# EAGLE schematic fmc-host (EAGLE 8.3.2)
DESIGNER: JON NEWMAN; DESIGN_NAME: FMC DESERIALIZER; LICENSE: CC BY-NC-SA 4.0; REVISION: 1.5
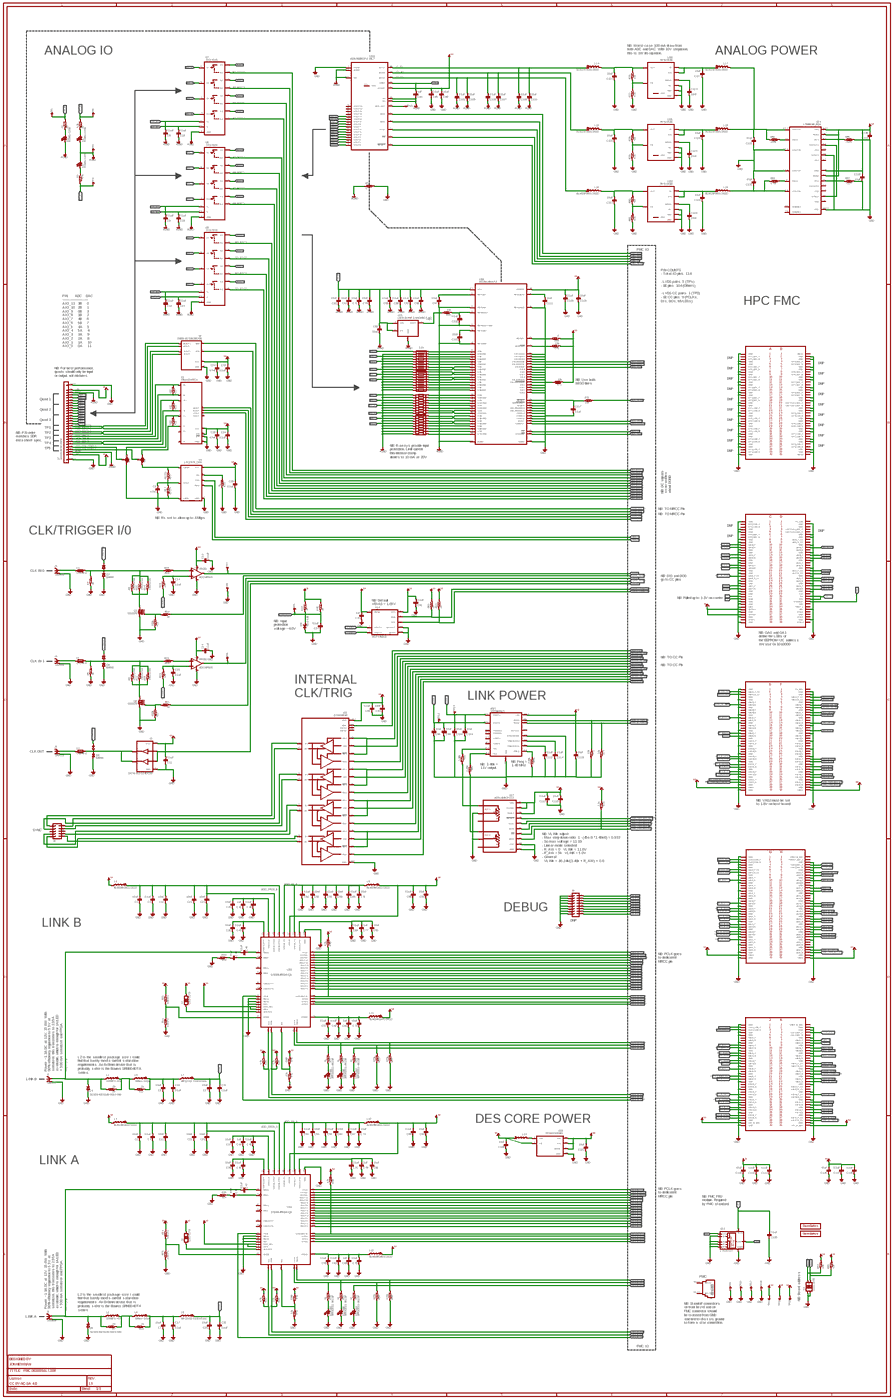
[diagram p0: schematic, sheet 1, overview]
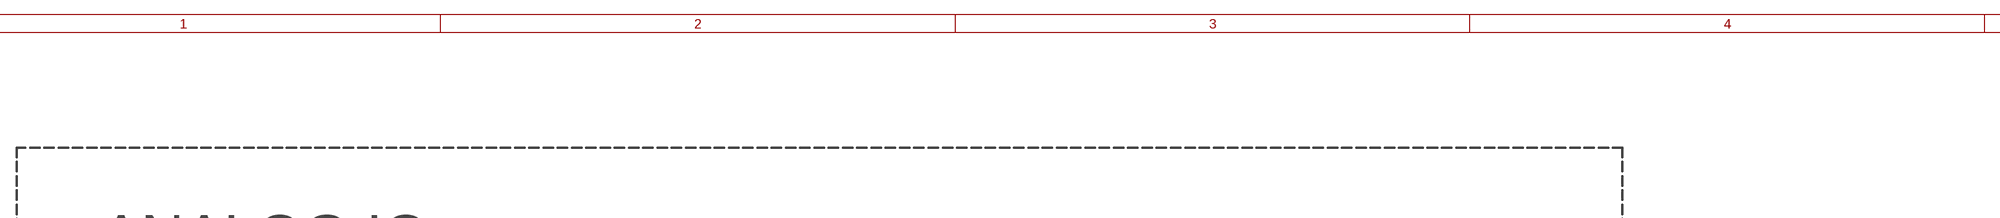
[diagram p1: schematic, sheet 1, part 1 of 8]
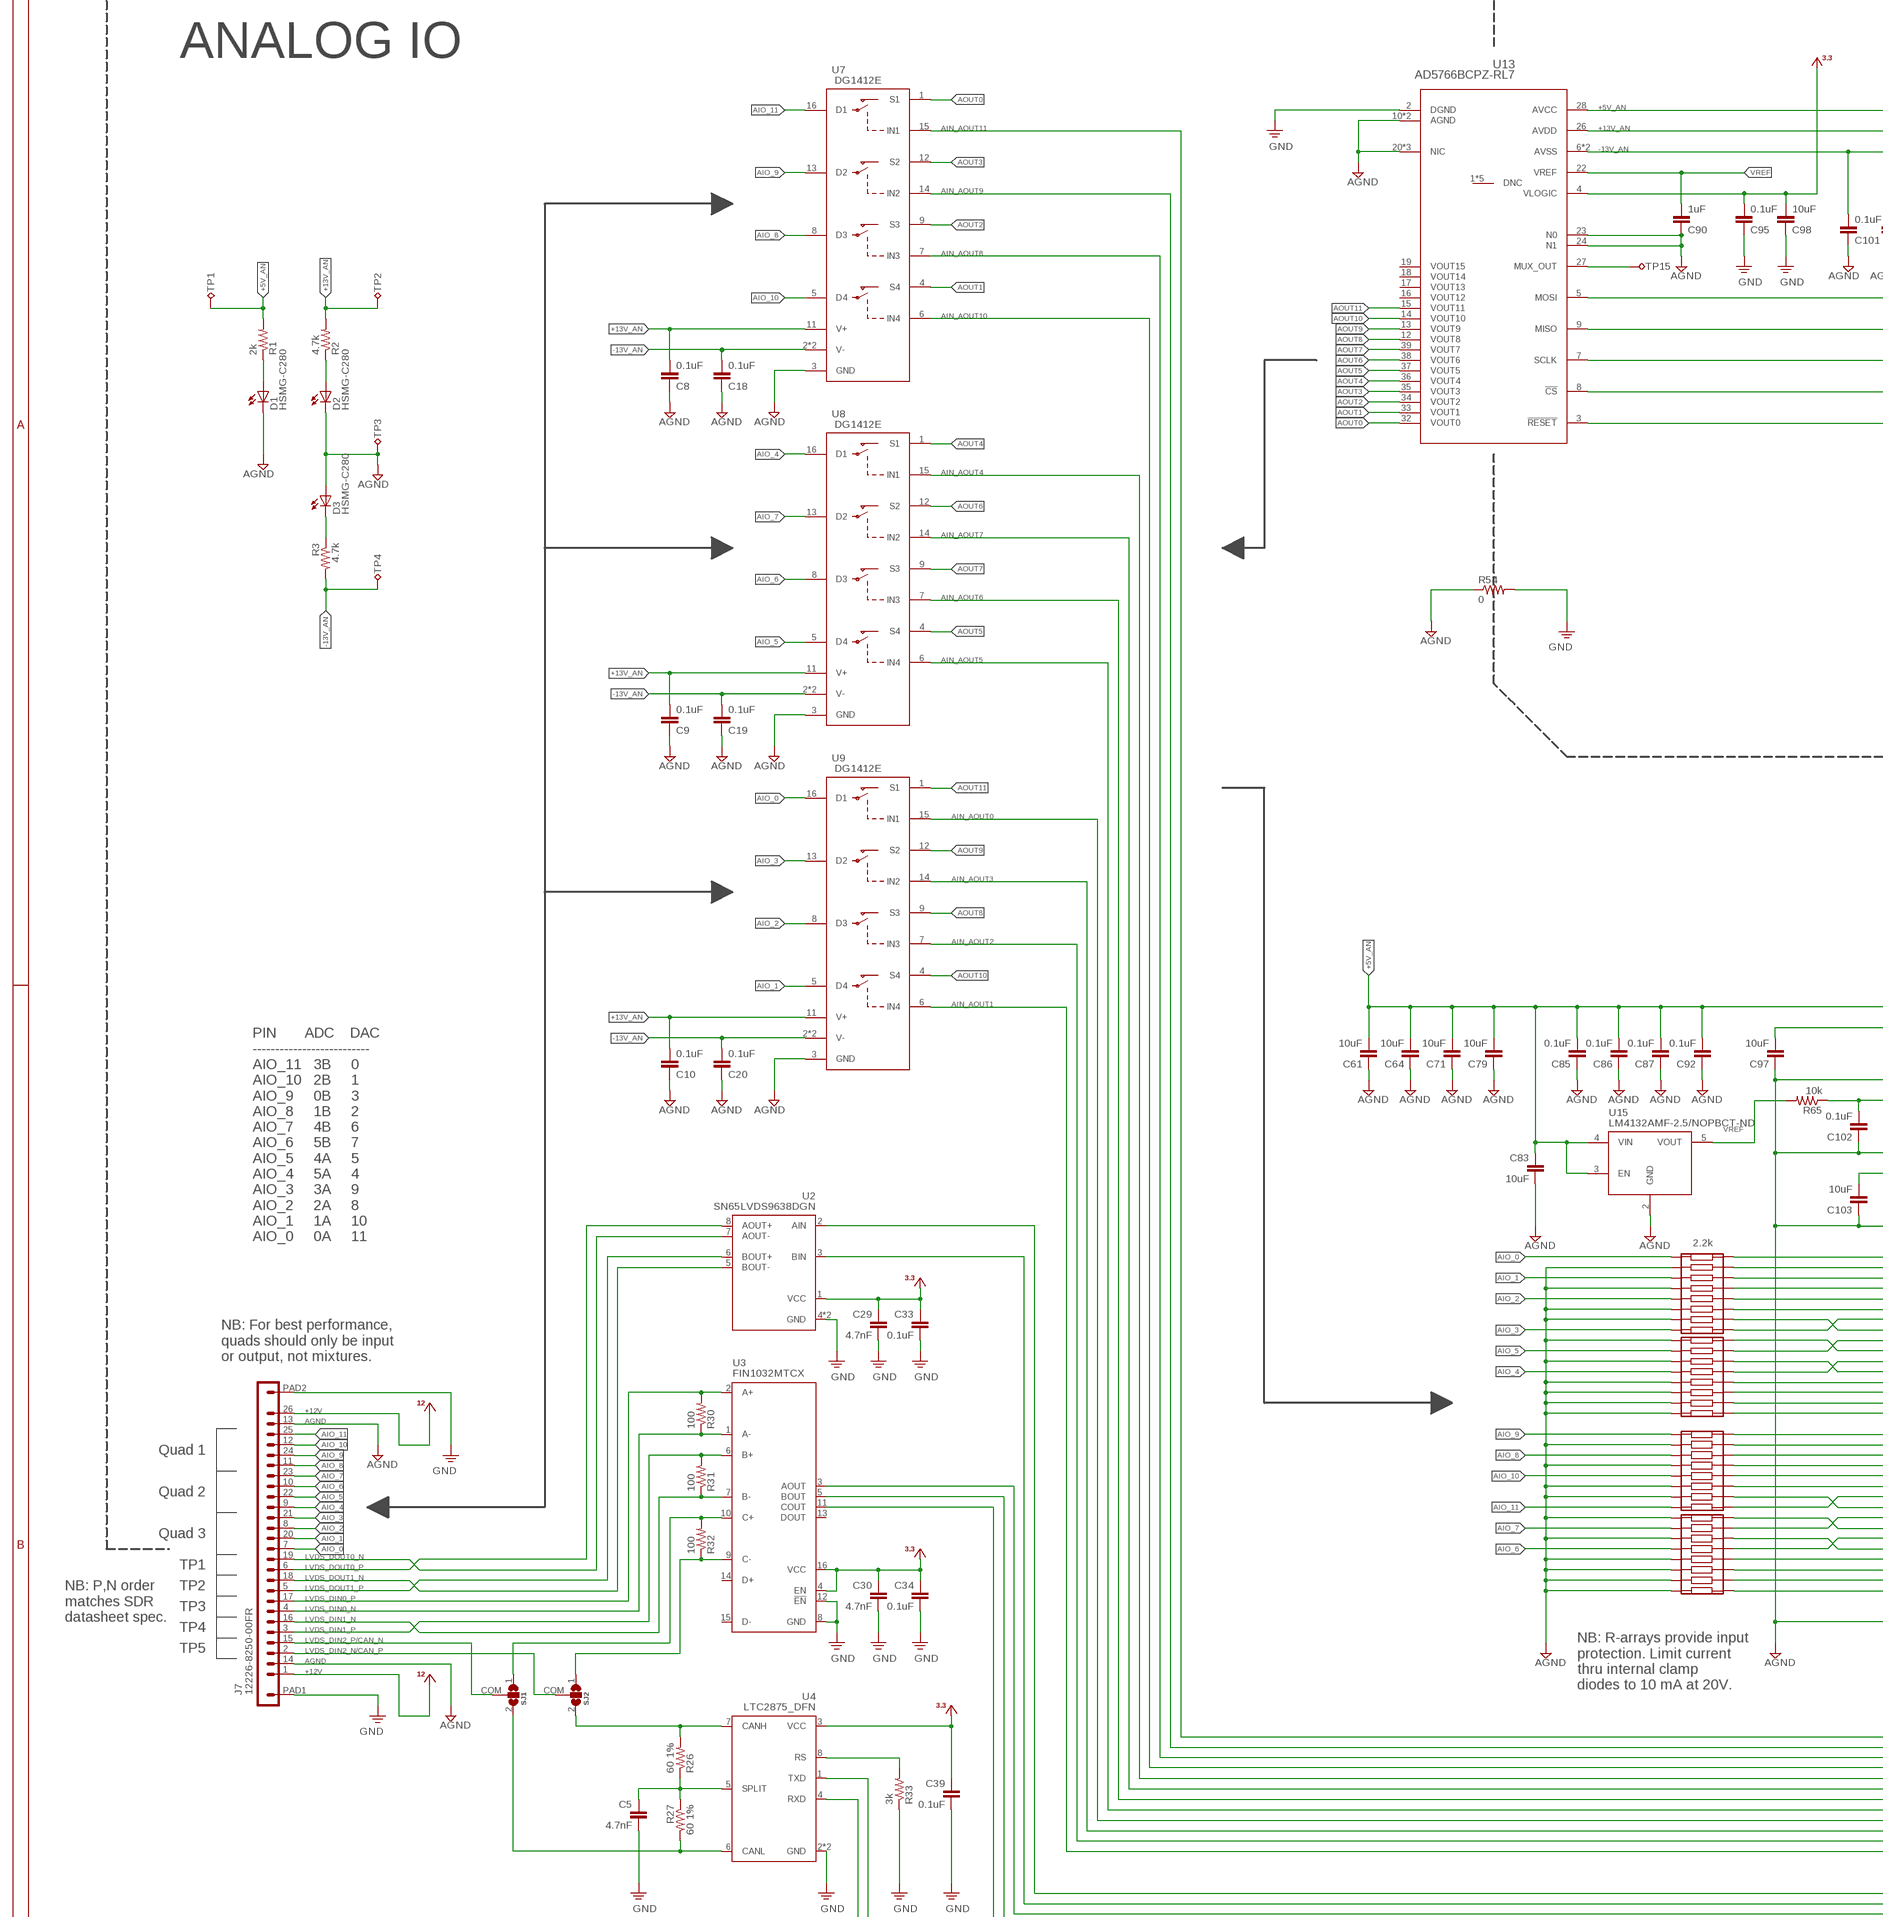
[diagram p2: schematic, sheet 1, part 2 of 8]
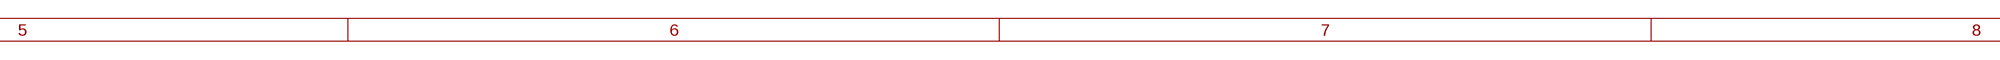
[diagram p3: schematic, sheet 1, part 3 of 8]
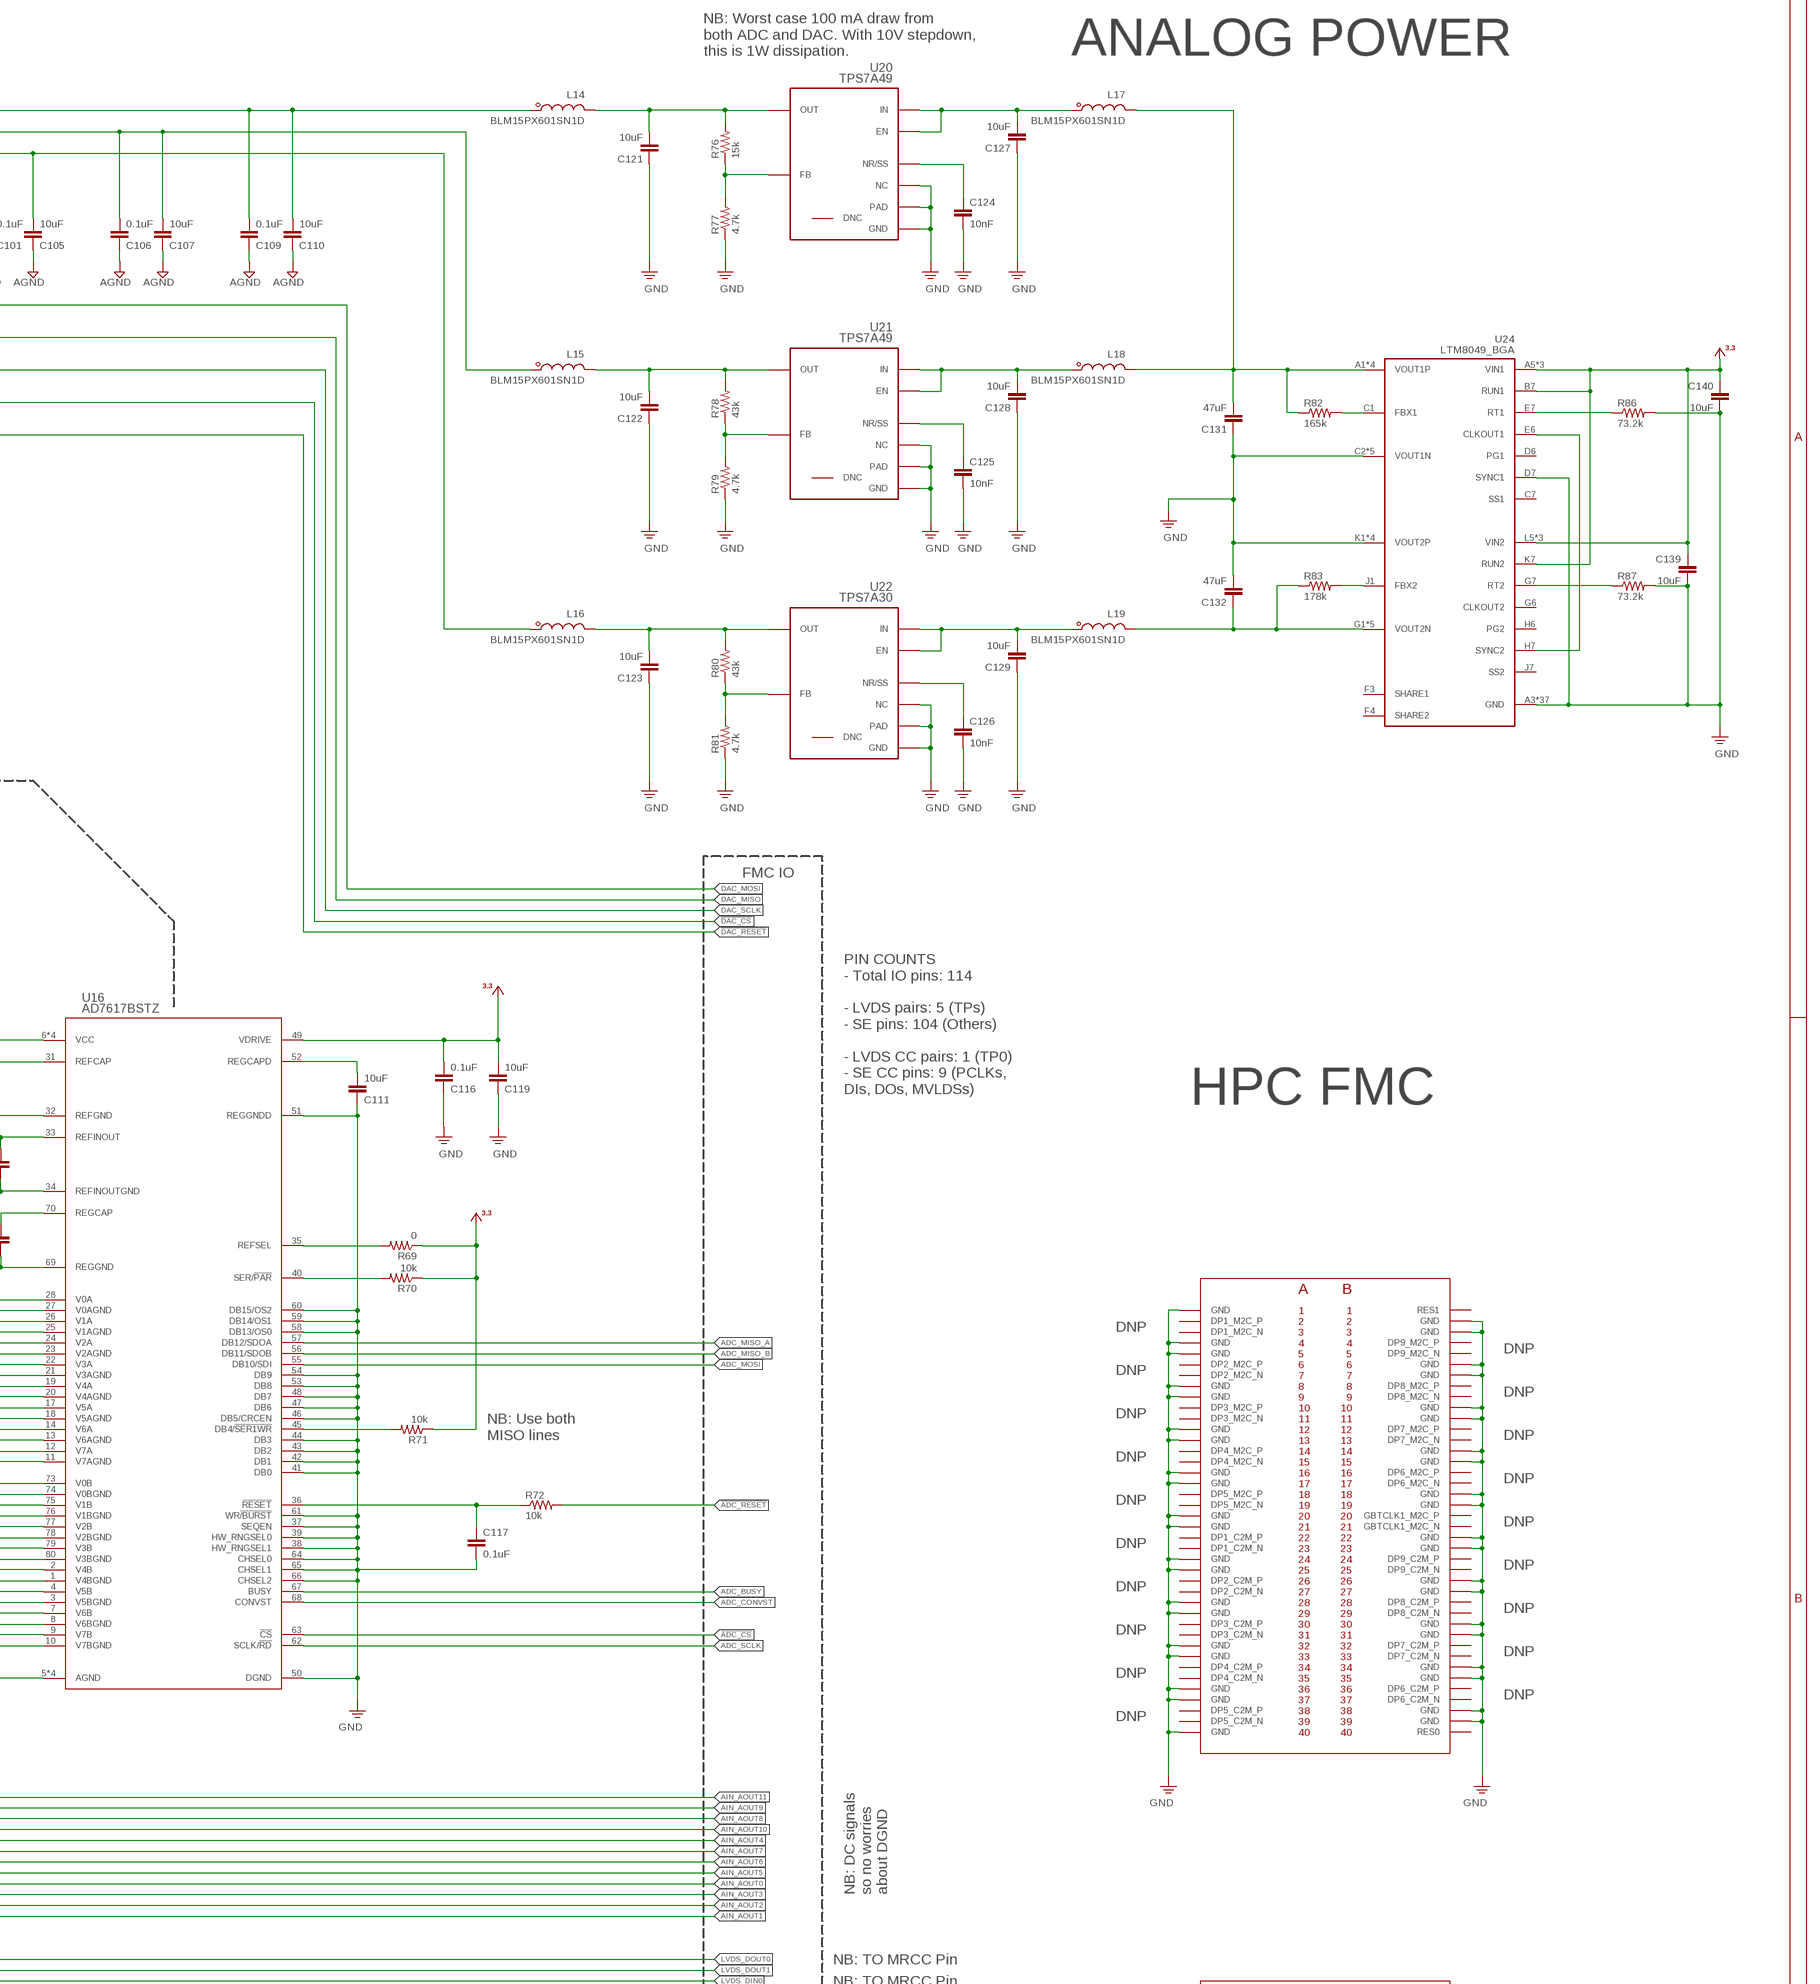
[diagram p4: schematic, sheet 1, part 4 of 8]
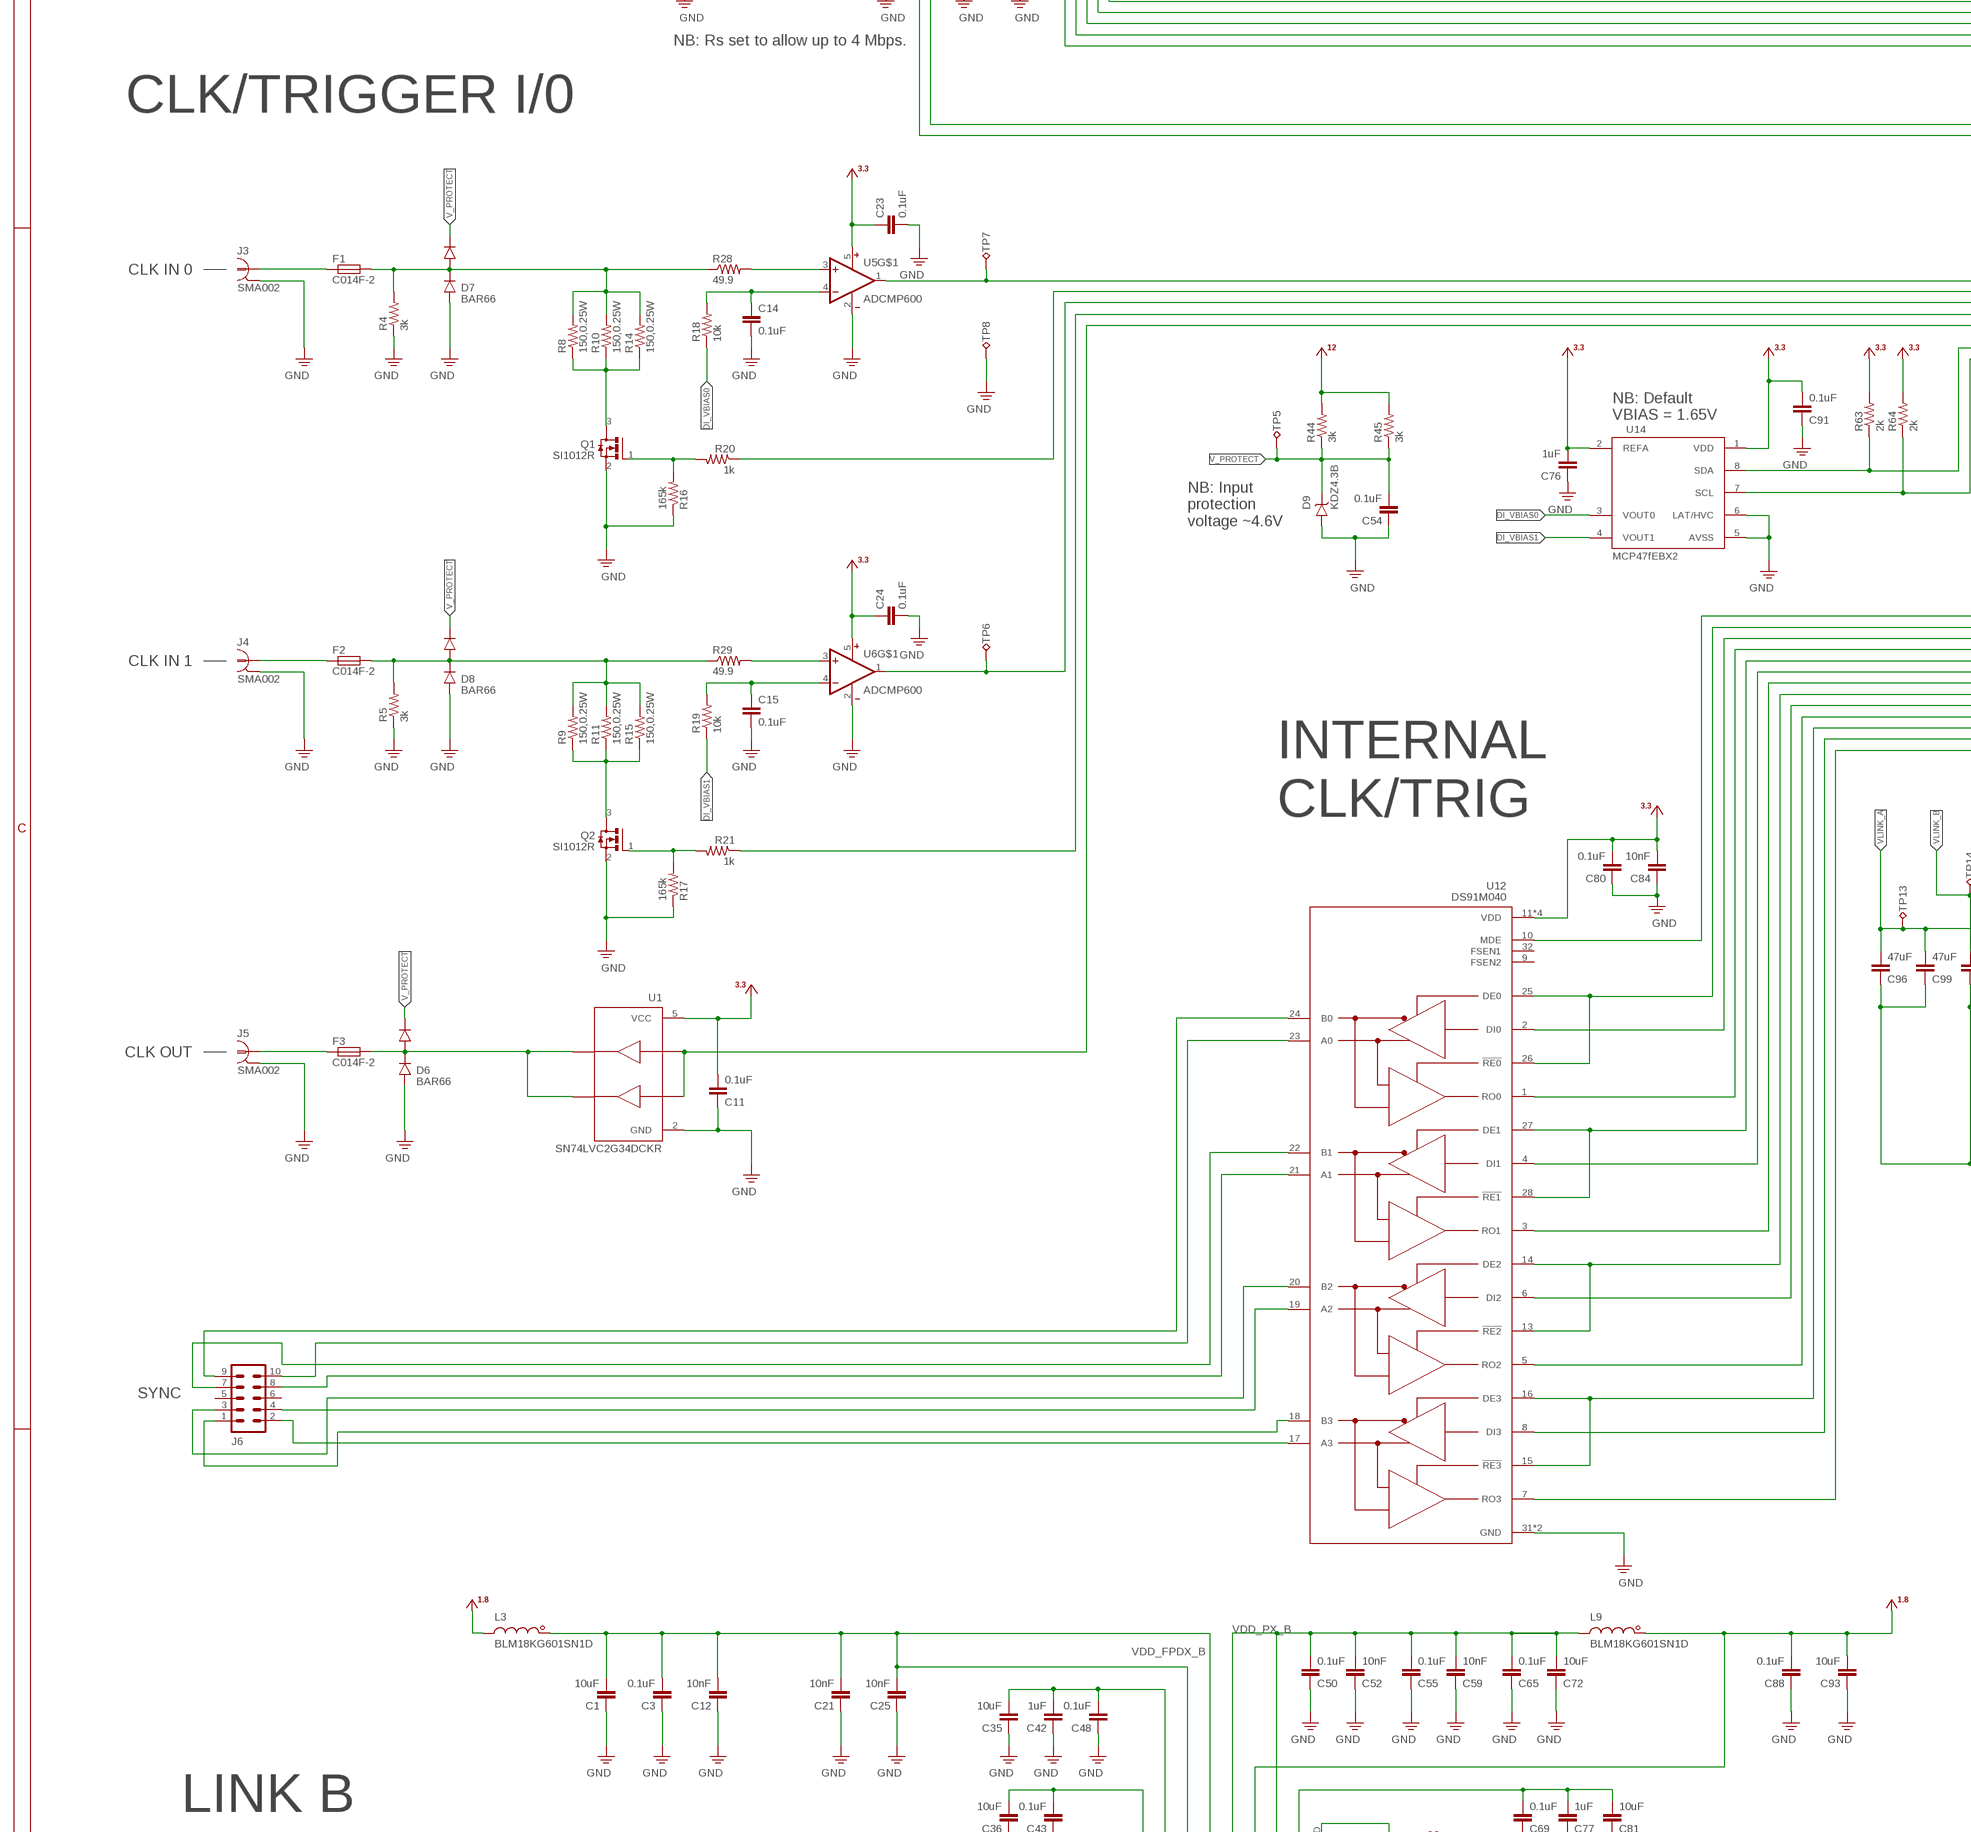
[diagram p5: schematic, sheet 1, part 5 of 8]
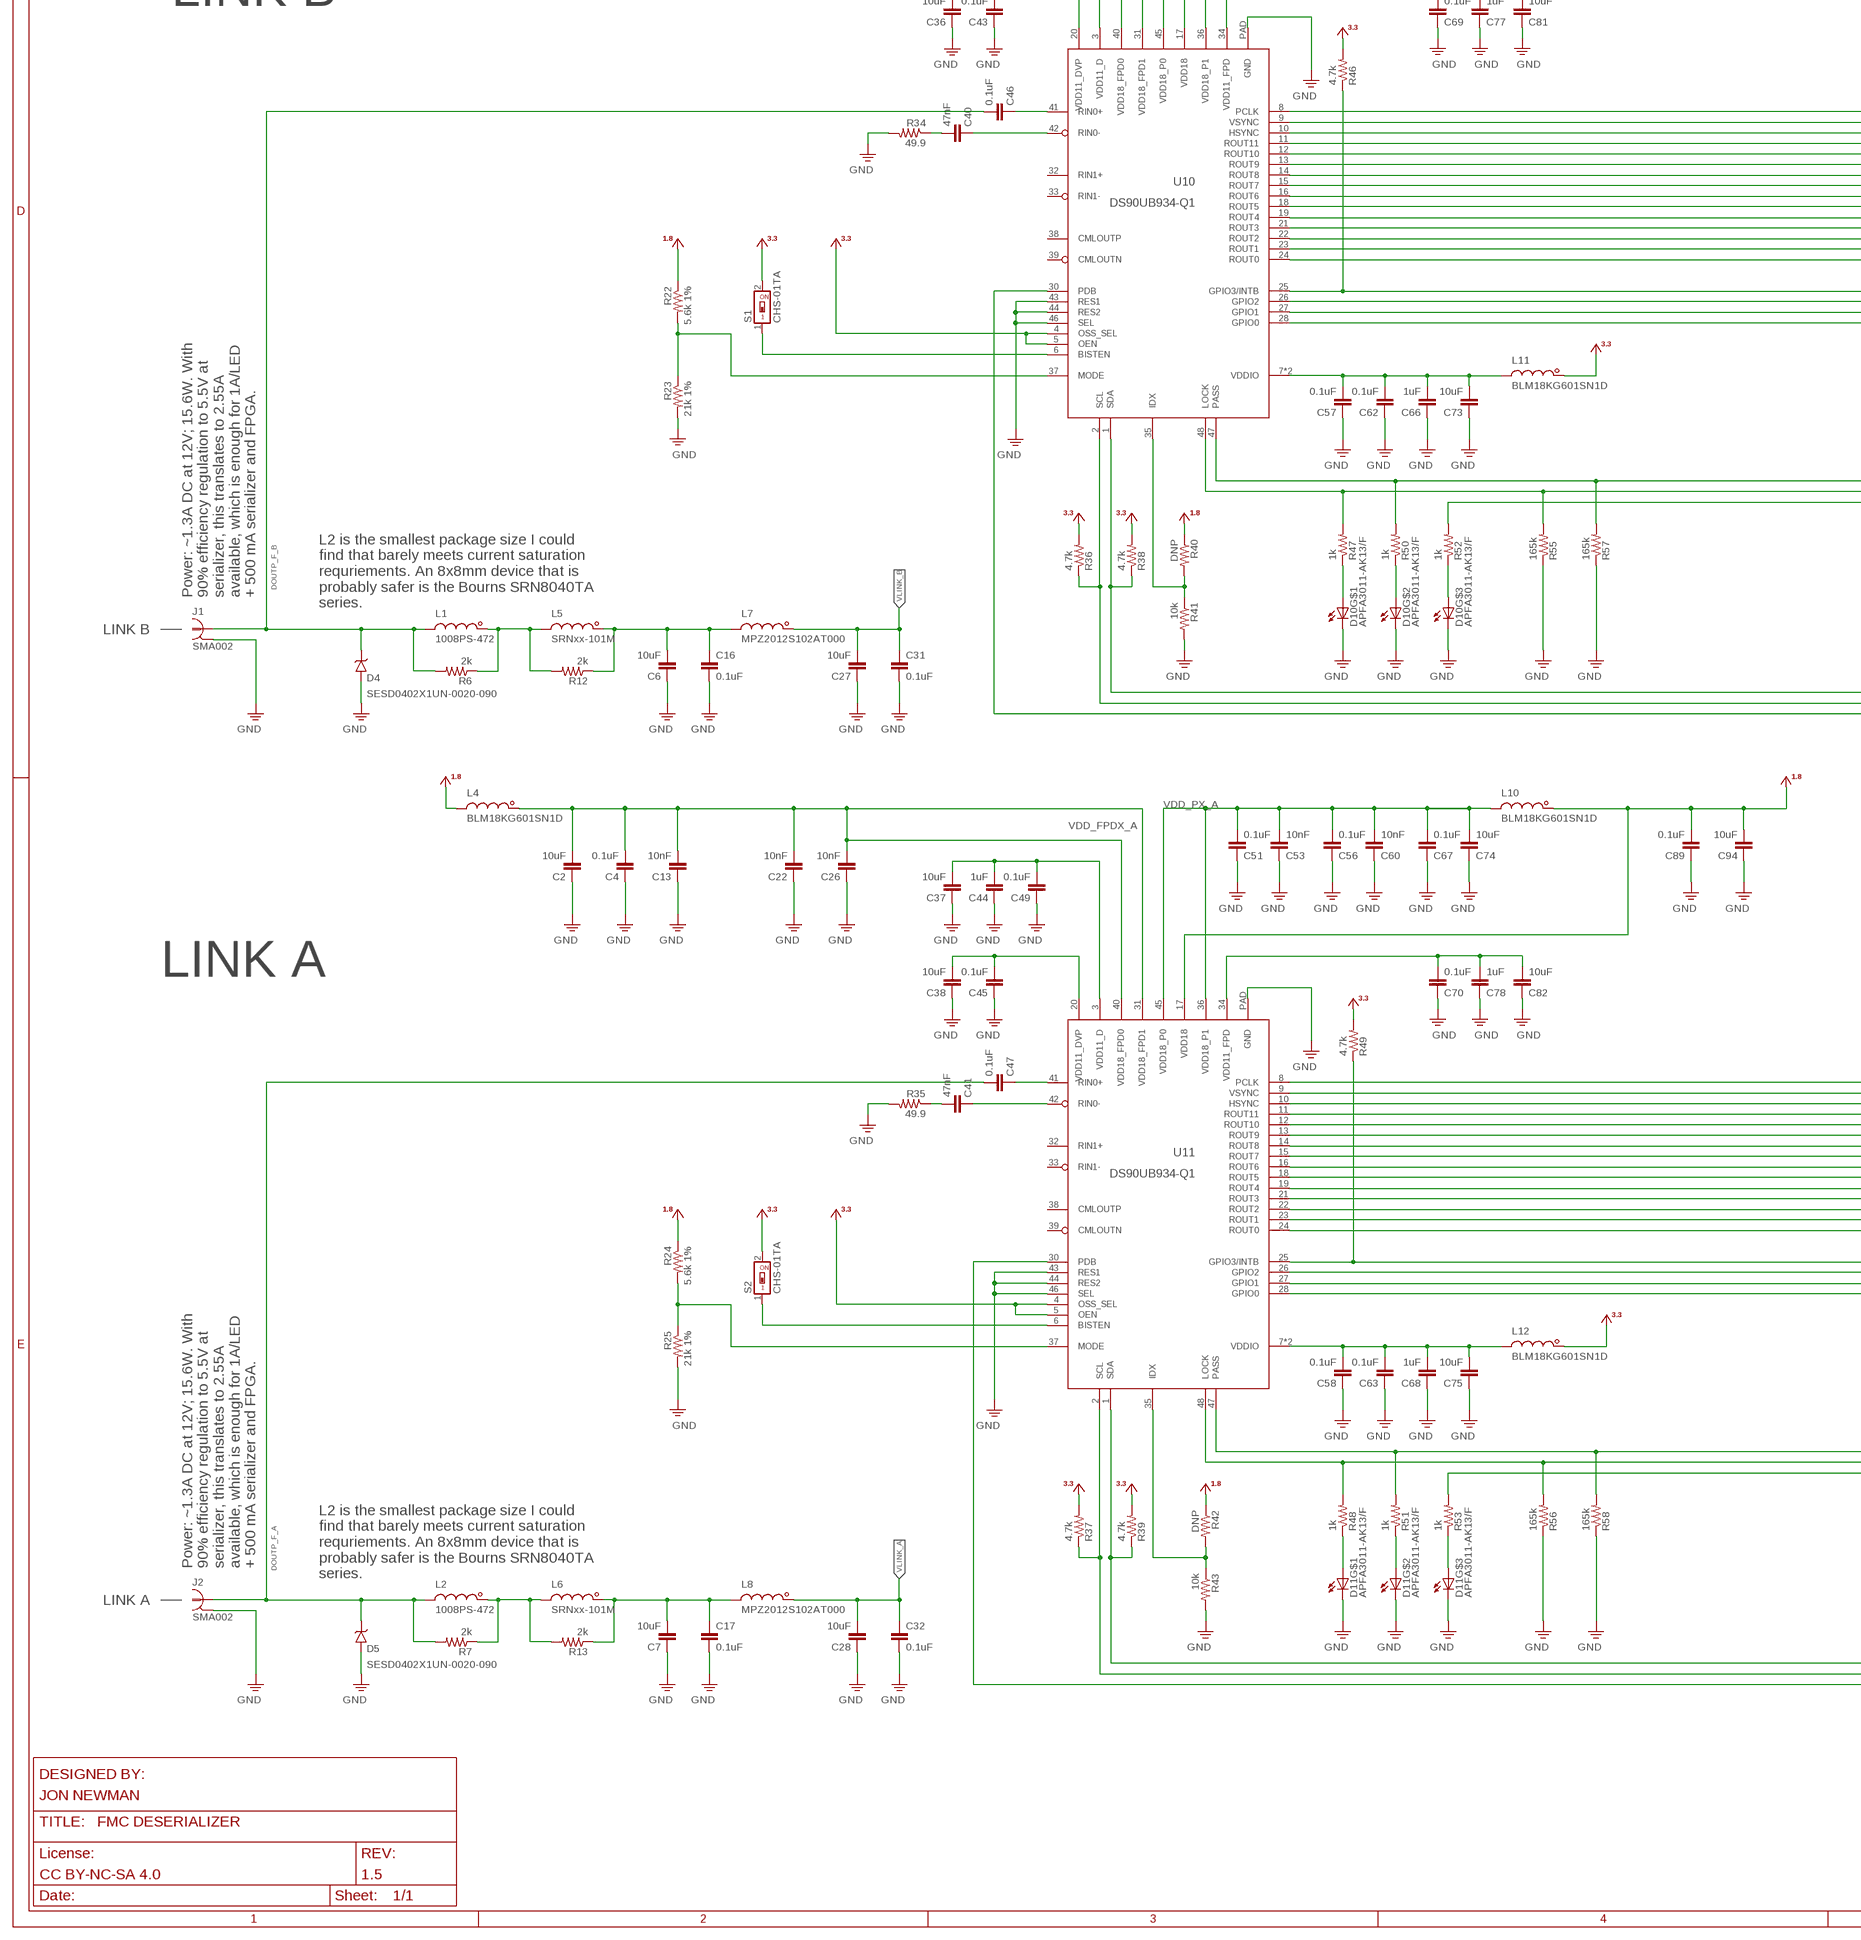
[diagram p6: schematic, sheet 1, part 6 of 8]
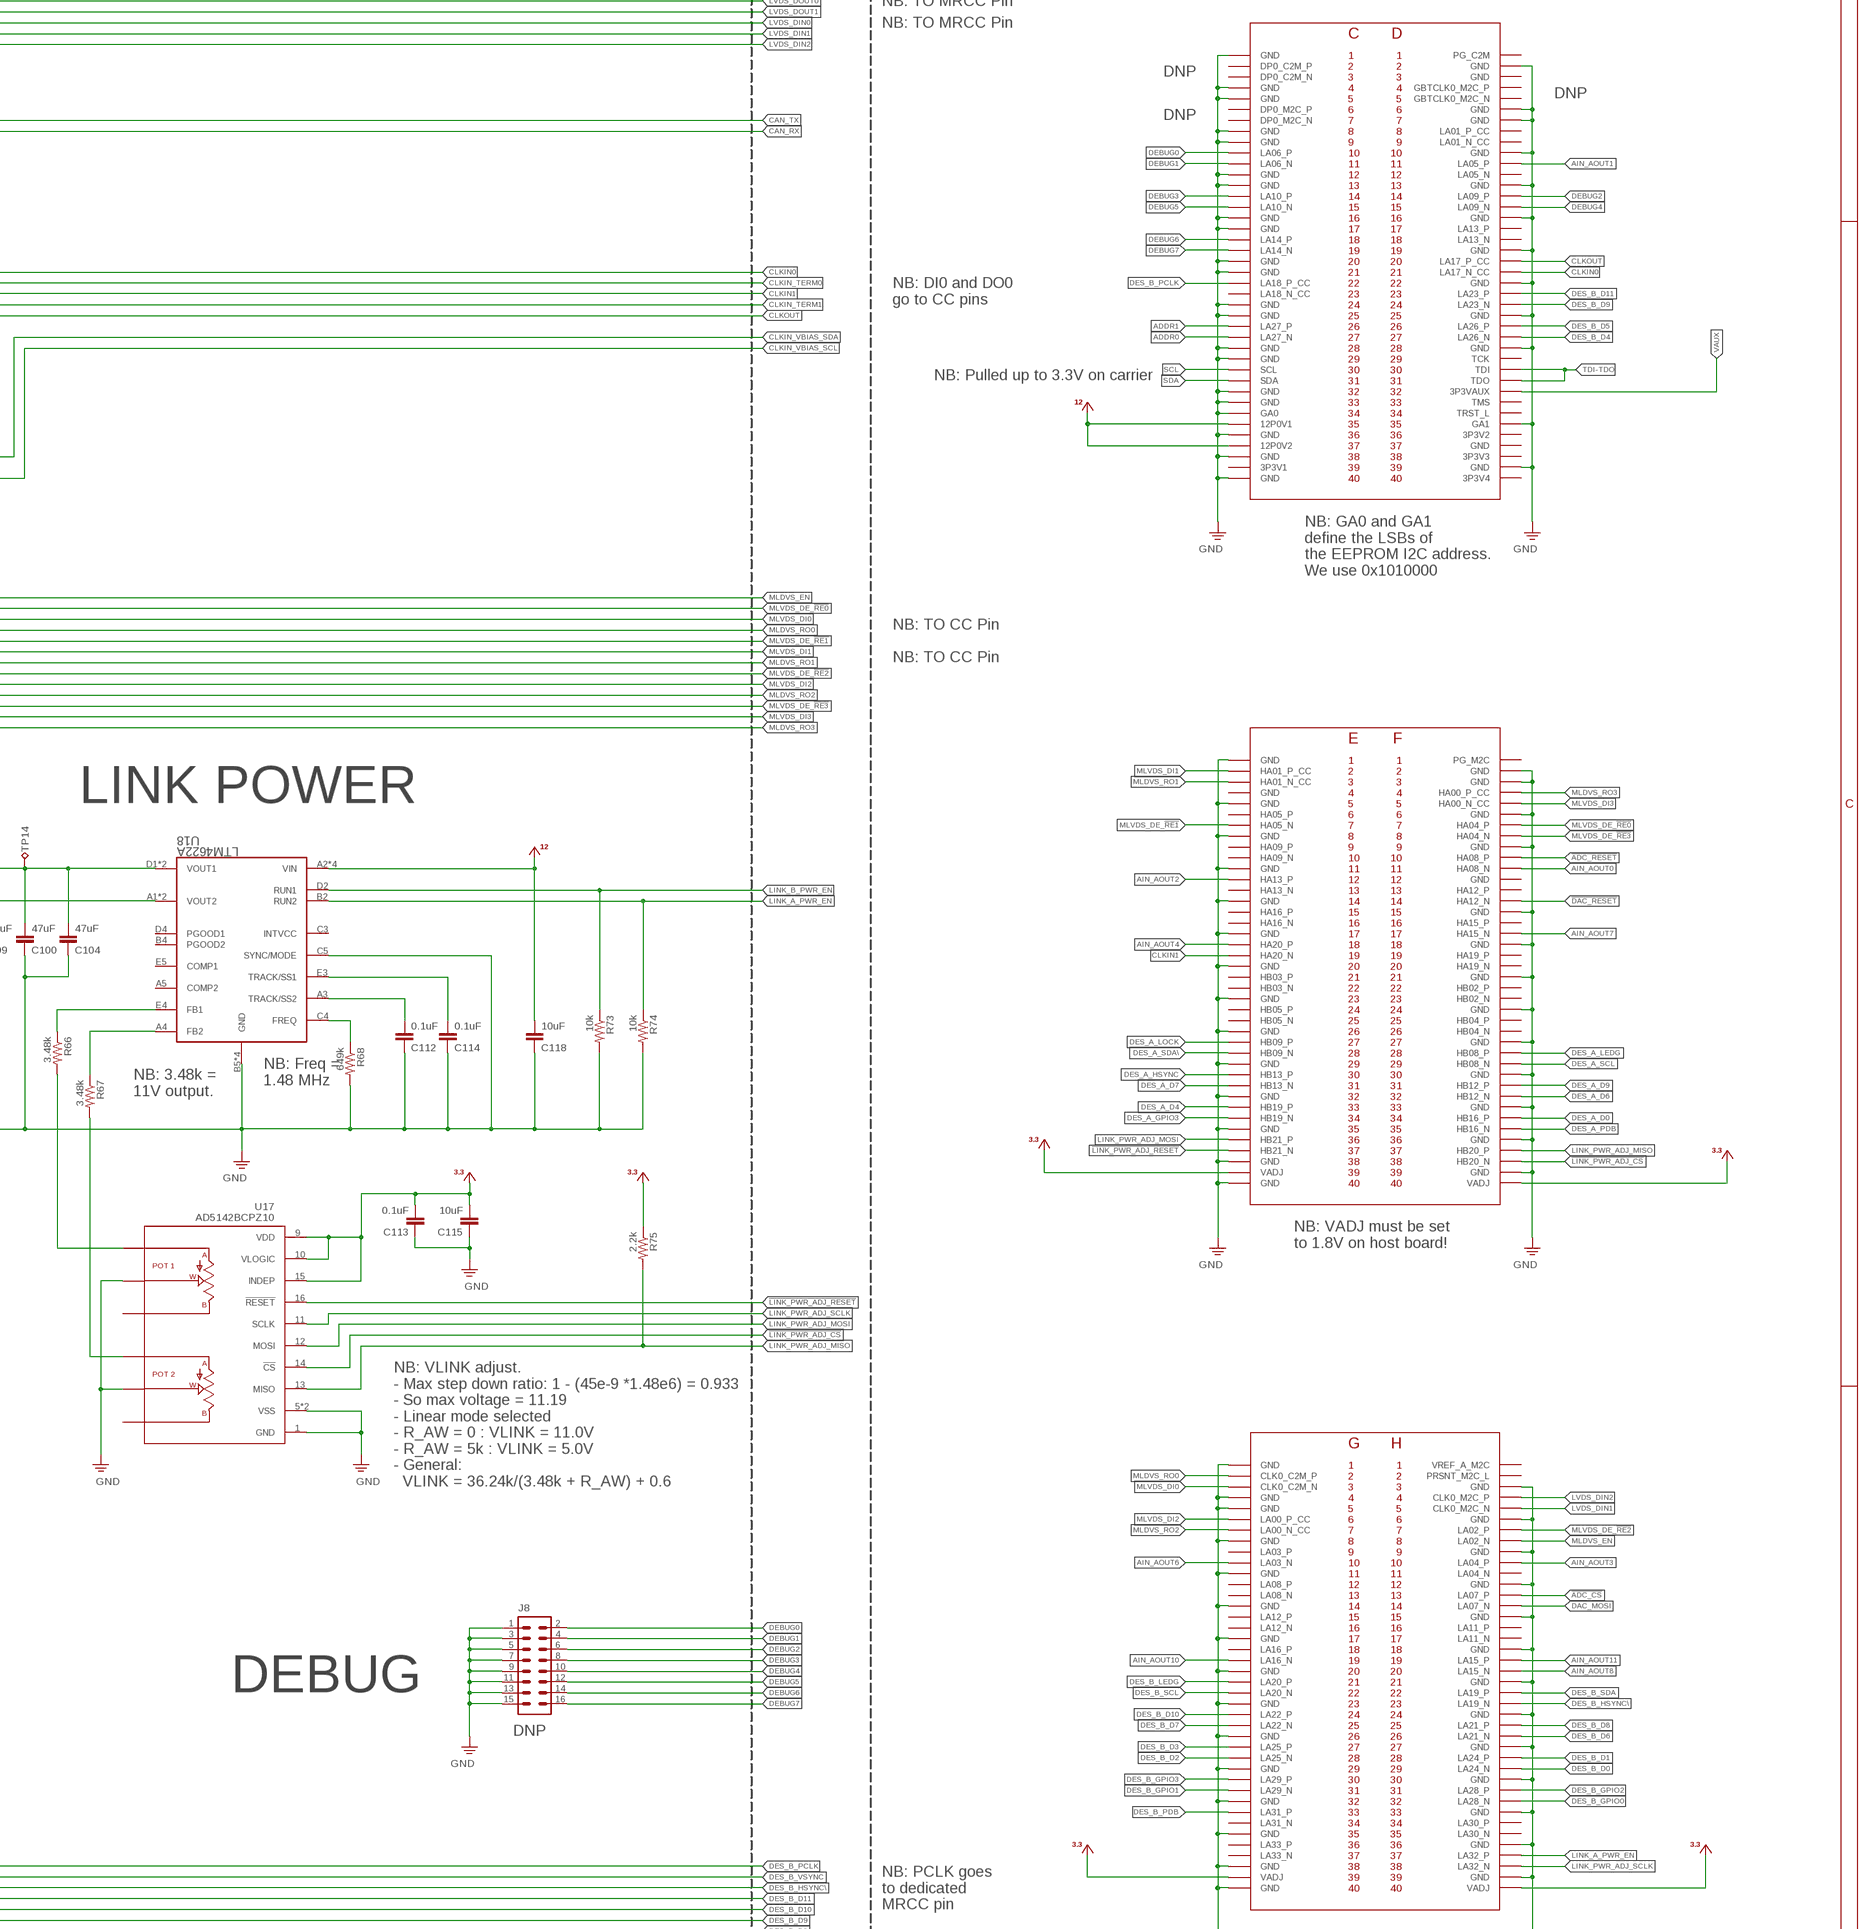
[diagram p7: schematic, sheet 1, part 7 of 8]
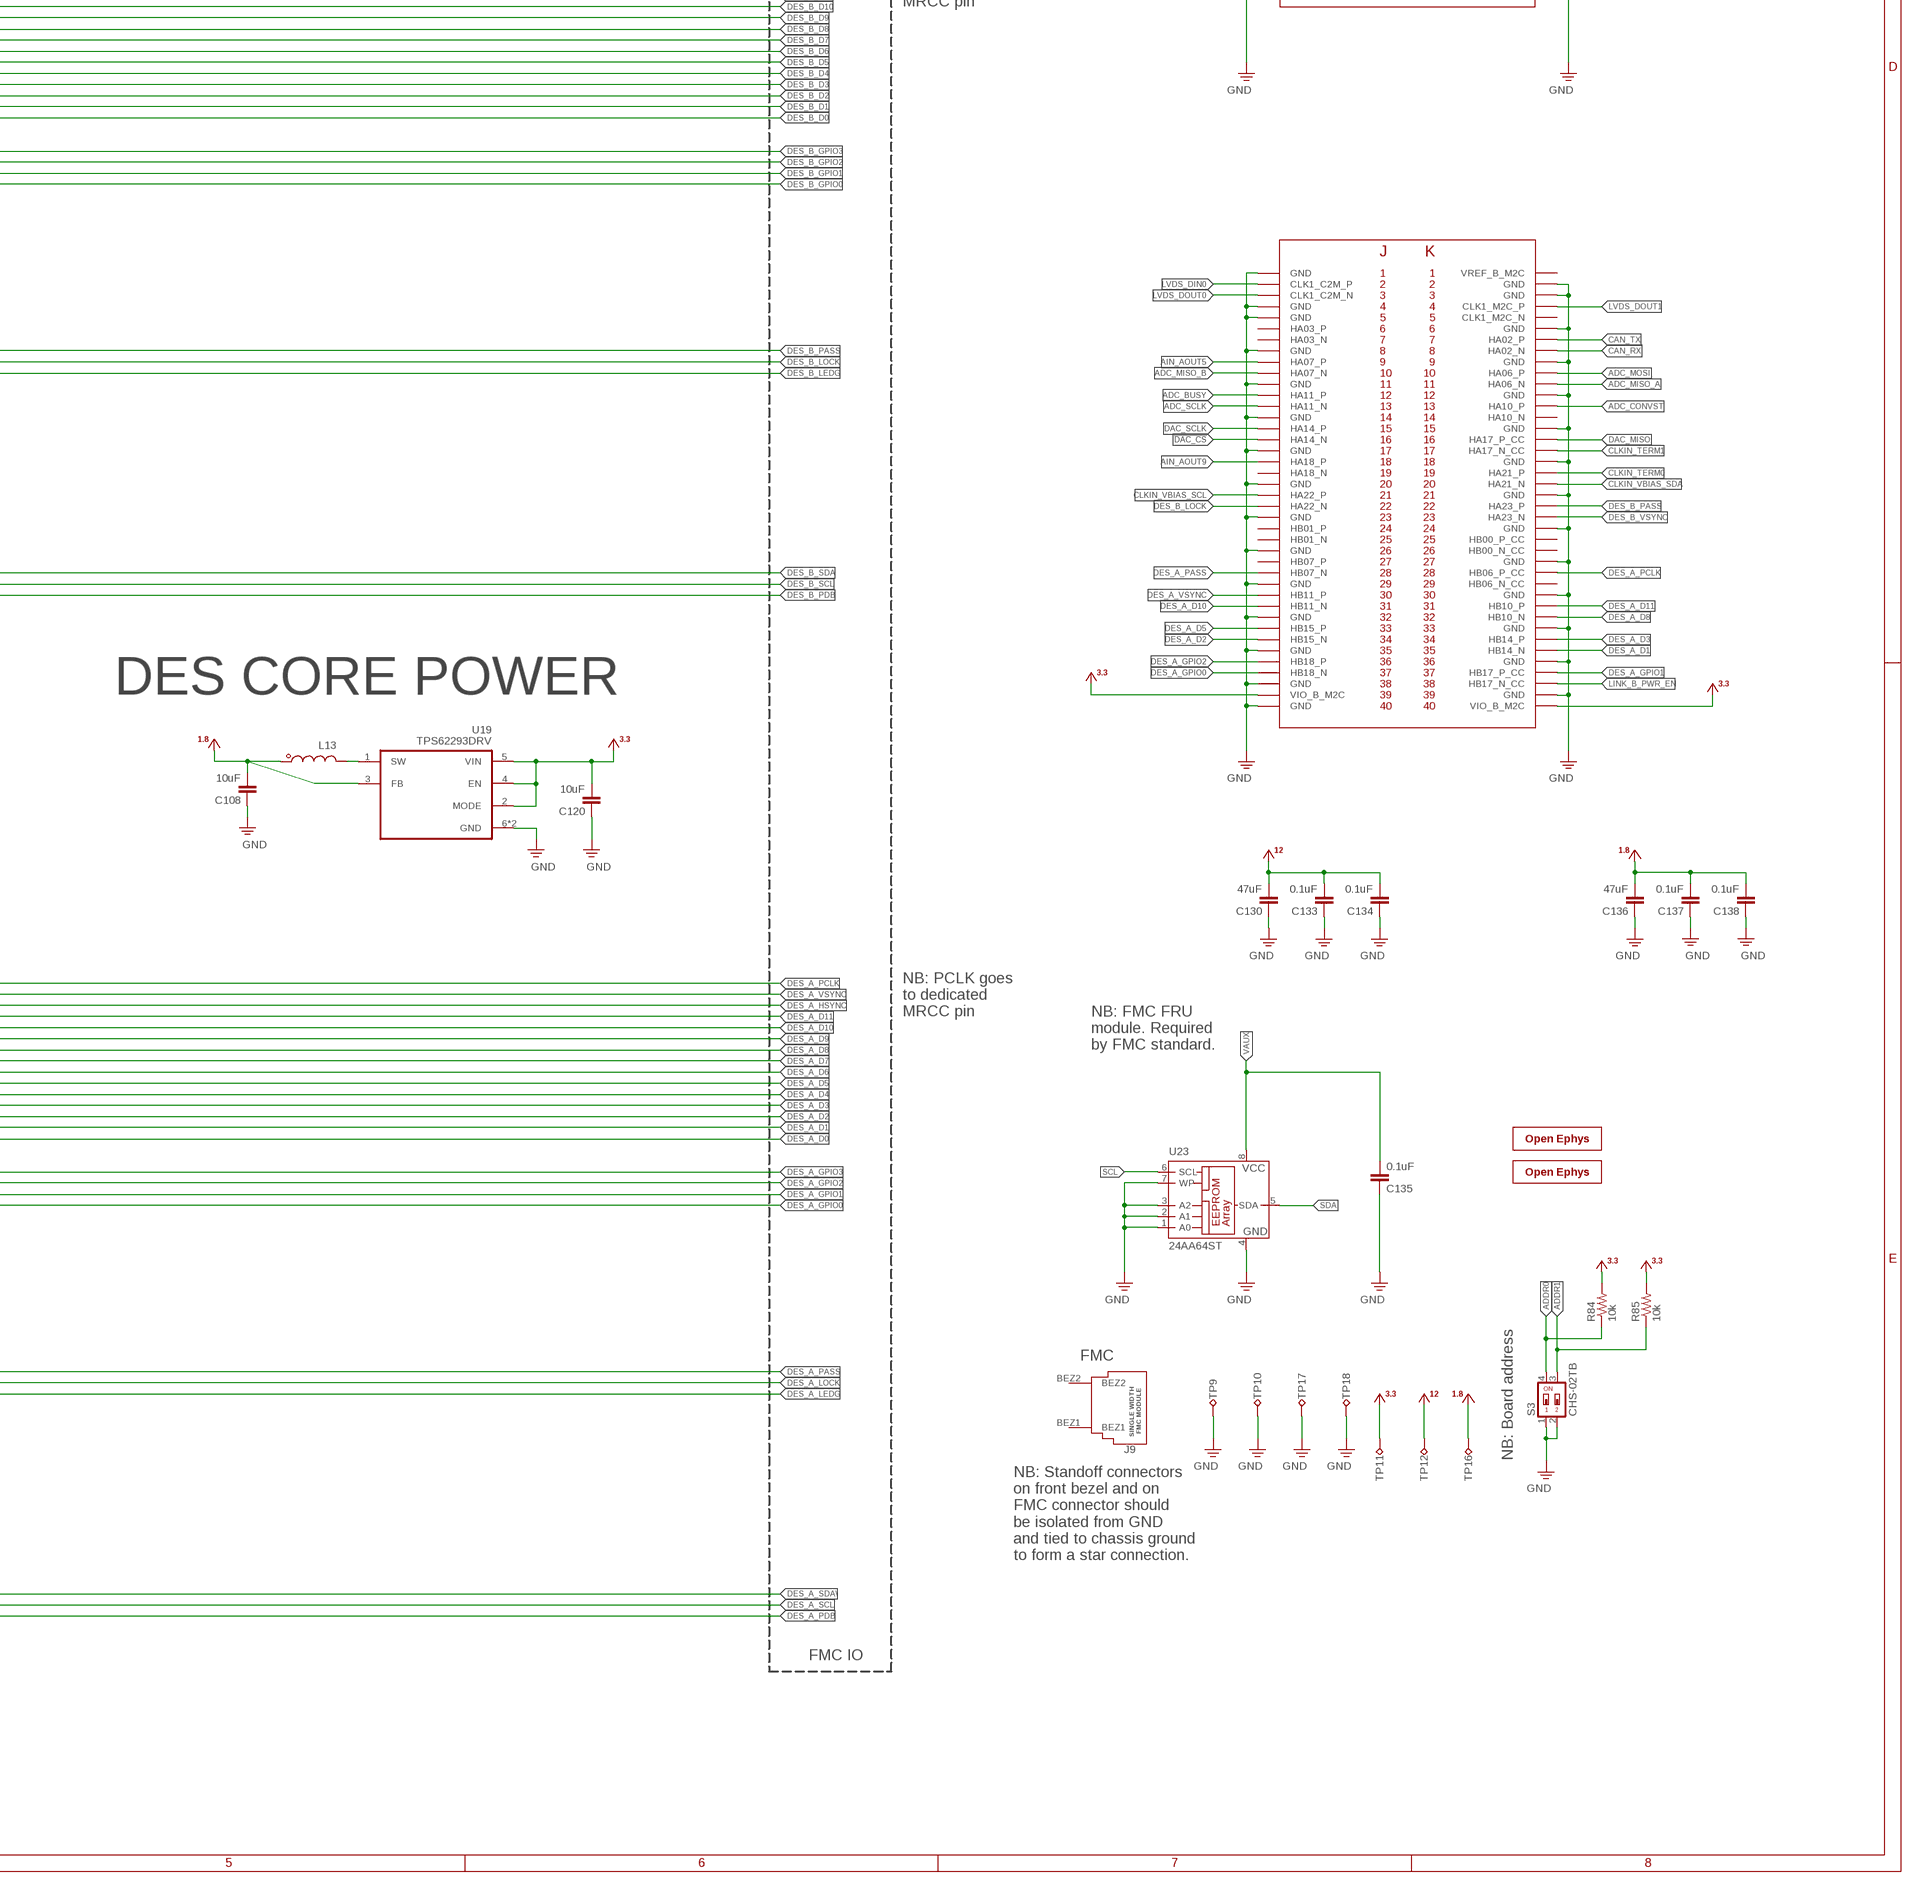
[diagram p8: schematic, sheet 1, part 8 of 8]

## Parts
C1  10uF  C_1206  [1206]
C2  10uF  C_1206  [1206]
C3  0.1uF  C_0402  [0402]
C4  0.1uF  C_0402  [0402]
C5  4.7nF  C_0402  [0402]
C6  10uF  C_1206  [1206]
C7  10uF  C_1206  [1206]
C8  0.1uF  C_0402  [0402]
C9  0.1uF  C_0402  [0402]
C10  0.1uF  C_0402  [0402]
C11  0.1uF  C_0402  [0402]
C12  10nF  C_0402  [0402]
C13  10nF  C_0402  [0402]
C14  0.1uF  C_0402  [0402]
C15  0.1uF  C_0402  [0402]
C16  0.1uF  C_0402  [0402]
C17  0.1uF  C_0402  [0402]
C18  0.1uF  C_0402  [0402]
C19  0.1uF  C_0402  [0402]
C20  0.1uF  C_0402  [0402]
C21  10nF  C_0402  [0402]
C22  10nF  C_0402  [0402]
C23  0.1uF  C_0402  [0402]
C24  0.1uF  C_0402  [0402]
C25  10nF  C_0402  [0402]
C26  10nF  C_0402  [0402]
C27  10uF  C_1206  [1206]
C28  10uF  C_1206  [1206]
C29  4.7nF  C_0402  [0402]
C30  4.7nF  C_0402  [0402]
C31  0.1uF  C_0402  [0402]
C32  0.1uF  C_0402  [0402]
C33  0.1uF  C_0402  [0402]
C34  0.1uF  C_0402  [0402]
C35  10uF  C_1206  [1206]
C36  10uF  C_1206  [1206]
C37  10uF  C_1206  [1206]
C38  10uF  C_1206  [1206]
C39  0.1uF  C_0402  [0402]
C40  47nF  C_0402  [0402]
C41  47nF  C_0402  [0402]
C42  1uF  C_0805  [0805]
C43  0.1uF  C_0402  [0402]
C44  1uF  C_0805  [0805]
C45  0.1uF  C_0402  [0402]
C46  0.1uF  C_0402  [0402]
C47  0.1uF  C_0402  [0402]
C48  0.1uF  C_0402  [0402]
C49  0.1uF  C_0402  [0402]
C50  0.1uF  C_0402  [0402]
C51  0.1uF  C_0402  [0402]
C52  10nF  C_0402  [0402]
C53  10nF  C_0402  [0402]
C54  0.1uF  C_0402  [0402]
C55  0.1uF  C_0402  [0402]
C56  0.1uF  C_0402  [0402]
C57  0.1uF  C_0402  [0402]
C58  0.1uF  C_0402  [0402]
C59  10nF  C_0402  [0402]
C60  10nF  C_0402  [0402]
C61  10uF  C_0805  [0805]
C62  0.1uF  C_0402  [0402]
C63  0.1uF  C_0402  [0402]
C64  10uF  C_0805  [0805]
C65  0.1uF  C_0402  [0402]
C66  1uF  C_0805  [0805]
C67  0.1uF  C_0402  [0402]
C68  1uF  C_0805  [0805]
C69  0.1uF  C_0402  [0402]
C70  0.1uF  C_0402  [0402]
C71  10uF  C_0805  [0805]
C72  10uF  C_1206  [1206]
C73  10uF  C_1206  [1206]
C74  10uF  C_1206  [1206]
C75  10uF  C_1206  [1206]
C76  1uF  C_0805  [0805]
C77  1uF  C_0805  [0805]
C78  1uF  C_0805  [0805]
C79  10uF  C_0805  [0805]
C80  0.1uF  C_0402  [0402]
C81  10uF  C_1206  [1206]
C82  10uF  C_1206  [1206]
C83  10uF  C_1206  [1206]
C84  10nF  C_0402  [0402]
C85  0.1uF  C_0402  [0402]
C86  0.1uF  C_0402  [0402]
C87  0.1uF  C_0402  [0402]
C88  0.1uF  C_0402  [0402]
C89  0.1uF  C_0402  [0402]
C90  1uF  C_0805  [0805]
C91  0.1uF  C_0402  [0402]
C92  0.1uF  C_0402  [0402]
C93  10uF  C_1206  [1206]
C94  10uF  C_1206  [1206]
C95  0.1uF  C_0402  [0402]
C96  47uF  C_1210  [1210]
C97  10uF  C_0805  [0805]
C98  10uF  C_0805  [0805]
C99  47uF  C_1210  [1210]
C100  47uF  C_1210  [1210]
C101  0.1uF  C_0402  [0402]
C102  0.1uF  C_0402  [0402]
C103  10uF  C_0805  [0805]
C104  47uF  C_1210  [1210]
C105  10uF  C_0805  [0805]
C106  0.1uF  C_0402  [0402]
C107  10uF  C_0805  [0805]
C108  10uF  C_1206  [1206]
C109  0.1uF  C_0402  [0402]
C110  10uF  C_0805  [0805]
C111  10uF  C_0805  [0805]
C112  0.1uF  C_0402  [0402]
C113  0.1uF  C_0402  [0402]
C114  0.1uF  C_0402  [0402]
C115  10uF  C_0805  [0805]
C116  0.1uF  C_0402  [0402]
C117  0.1uF  C_0402  [0402]
C118  10uF  C_0805  [0805]
C119  10uF  C_0805  [0805]
C120  10uF  C_1206  [1206]
C121  10uF  C_0805  [0805]
C122  10uF  C_0805  [0805]
C123  10uF  C_0805  [0805]
C124  10nF  C_0402  [0402]
C125  10nF  C_0402  [0402]
C126  10nF  C_0402  [0402]
C127  10uF  C_0805  [0805]
C128  10uF  C_0805  [0805]
C129  10uF  C_0805  [0805]
C130  47uF  C_1210  [1210]
C131  47uF  C_1210  [1210]
C132  47uF  C_1210  [1210]
C133  0.1uF  C_0402  [0402]
C134  0.1uF  C_0402  [0402]
C135  0.1uF  C_0402  [0402]
C136  47uF  C_1210  [1210]
C137  0.1uF  C_0402  [0402]
C138  0.1uF  C_0402  [0402]
C139  10uF  C_1206  [1206]
C140  10uF  C_1206  [1206]
D1  HSMG-C280  LED_0402  [LED-0402]
D2  HSMG-C280  LED_0402  [LED-0402]
D3  HSMG-C280  LED_0402  [LED-0402]
D4  SESD0402X1UN-0020-090  Z-DIODE_0402P-DFN  [0402P-DFN]
D5  SESD0402X1UN-0020-090  Z-DIODE_0402P-DFN  [0402P-DFN]
D6  BAR66  DIODE2_SOT23  [SOT23]
D7  BAR66  DIODE2_SOT23  [SOT23]
D8  BAR66  DIODE2_SOT23  [SOT23]
D9  KDZ4.3B  Z-DIODE_SOD123  [SOD123]
D10  APFA3011-AK13/F  LED_3X_SMD-6  [RGB_LED_SMD-6]
D11  APFA3011-AK13/F  LED_3X_SMD-6  [RGB_LED_SMD-6]
F1  C014F-2  FUSE_1812  [1812]
F2  C014F-2  FUSE_1812  [1812]
F3  C014F-2  FUSE_1812  [1812]
J1  SMA002  COAX_MMCX-THRU  [MMCX-THRU]
J2  SMA002  COAX_MMCX-THRU  [MMCX-THRU]
J3  SMA002  COAX_MMCX-THRU  [MMCX-THRU]
J4  SMA002  COAX_MMCX-THRU  [MMCX-THRU]
J5  SMA002  COAX_MMCX-THRU  [MMCX-THRU]
J6  ESHF-105-01-L-D-SM-K-TR  PINHD-2X5_ESHF-SM  [ESHF-105-01-L-D-SM-K-TR]
J7  12226-8250-00FR  PINHD-1X26_122  [12226-82X0-00XX]
J8  95278-101A16LF  PINHD-2X8_SMD  [JP2X8_SMD]
J9  FMC_SINGLE_WIDTH_MODULE  [FMC_SINGLE_WIDTH_MODULE]
J10  ASP-134488-01  FMC_HPC_400_PIN_MALE  [FMC_HPC_MALE]
L1  1008PS-472  L_1008PS  [1008PS]
L2  1008PS-472  L_1008PS  [1008PS]
L3  BLM18KG601SN1D  L_0603  [0603]
L4  BLM18KG601SN1D  L_0603  [0603]
L5  SRNxx-101M  L_SRN6045TA  [SRN6045TA]
L6  SRNxx-101M  L_SRN6045TA  [SRN6045TA]
L7  MPZ2012S102AT000  L_0805  [0805]
L8  MPZ2012S102AT000  L_0805  [0805]
L9  BLM18KG601SN1D  L_0603  [0603]
L10  BLM18KG601SN1D  L_0603  [0603]
L11  BLM18KG601SN1D  L_0603  [0603]
L12  BLM18KG601SN1D  L_0603  [0603]
L13  L_1210  [1210]
L14  BLM15PX601SN1D  L_0402  [0402]
L15  BLM15PX601SN1D  L_0402  [0402]
L16  BLM15PX601SN1D  L_0402  [0402]
L17  BLM15PX601SN1D  L_0402  [0402]
L18  BLM15PX601SN1D  L_0402  [0402]
L19  BLM15PX601SN1D  L_0402  [0402]
Q1  SI1012R  N-MOSFET_SC75-GSD  [SC75]
Q2  SI1012R  N-MOSFET_SC75-GSD  [SC75]
R1  2k  R_0402  [0402]
R2  4.7k  R_0402  [0402]
R3  4.7k  R_0402  [0402]
R4  3k  R_0402  [0402]
R5  3k  R_0402  [0402]
R6  2k  R_0402  [0402]
R7  2k  R_0402  [0402]
R8  150,0.25W  R_0603  [0603]
R9  150,0.25W  R_0603  [0603]
R10  150,0.25W  R_0603  [0603]
R11  150,0.25W  R_0603  [0603]
R12  2k  R_0402  [0402]
R13  2k  R_0402  [0402]
R14  150,0.25W  R_0603  [0603]
R15  150,0.25W  R_0603  [0603]
R16  165k  R_0402  [0402]
R17  165k  R_0402  [0402]
R18  10k  R_0402  [0402]
R19  10k  R_0402  [0402]
R20  1k  R_0402  [0402]
R21  1k  R_0402  [0402]
R22  5.6k 1%  R_0402  [0402]
R23  21k 1%  R_0402  [0402]
R24  5.6k 1%  R_0402  [0402]
R25  21k 1%  R_0402  [0402]
R26  60 1%  R_0402  [0402]
R27  60 1%  R_0402  [0402]
R28  49.9  R_0402  [0402]
R29  49.9  R_0402  [0402]
R30  100  R_0402  [0402]
R31  100  R_0402  [0402]
R32  100  R_0402  [0402]
R33  3k  R_0402  [0402]
R34  49.9  R_0402  [0402]
R35  49.9  R_0402  [0402]
R36  4.7k  R_0402  [0402]
R37  4.7k  R_0402  [0402]
R38  4.7k  R_0402  [0402]
R39  4.7k  R_0402  [0402]
R40  DNP  R_0402  [0402]
R41  10k  R_0402  [0402]
R42  DNP  R_0402  [0402]
R43  10k  R_0402  [0402]
R44  3k  R_0402  [0402]
R45  3k  R_0402  [0402]
R46  4.7k  R_0402  [0402]
R47  1k  R_0402  [0402]
R48  1k  R_0402  [0402]
R49  4.7k  R_0402  [0402]
R50  1k  R_0402  [0402]
R51  1k  R_0402  [0402]
R52  1k  R_0402  [0402]
R53  1k  R_0402  [0402]
R54  0  R_0402  [0402]
R55  165k  R_0402  [0402]
R56  165k  R_0402  [0402]
R57  165k  R_0402  [0402]
R58  165k  R_0402  [0402]
R59  2.2k  RN2X8_1506  [RN2X8-1506]
R60  2.2k  RN2X8_1506  [RN2X8-1506]
R61  2.2k  RN2X8_1506  [RN2X8-1506]
R62  2.2k  RN2X8_1506  [RN2X8-1506]
R63  2k  R_0402  [0402]
R64  2k  R_0402  [0402]
R65  10k  R_0402  [0402]
R66  3.48k  R_0402  [0402]
R67  3.48k  R_0402  [0402]
R68  649k  R_0402  [0402]
R69  0  R_0402  [0402]
R70  10k  R_0402  [0402]
R71  10k  R_0402  [0402]
R72  10k  R_0402  [0402]
R73  10k  R_0402  [0402]
R74  10k  R_0402  [0402]
R75  2.2k  R_0402  [0402]
R76  15k  R_0402  [0402]
R77  4.7k  R_0402  [0402]
R78  43k  R_0402  [0402]
R79  4.7k  R_0402  [0402]
R80  43k  R_0402  [0402]
R81  4.7k  R_0402  [0402]
R82  165k  R_0402  [0402]
R83  178k  R_0402  [0402]
R84  10k  R_0402  [0402]
R85  10k  R_0402  [0402]
R86  73.2k  R_0402  [0402]
R87  73.2k  R_0402  [0402]
S1  CHS-01TA  DIPSW-001_GULL  [DIP01-SMD-GULL]
S2  CHS-01TA  DIPSW-001_GULL  [DIP01-SMD-GULL]
S3  CHS-02TB  DIPSW-002_CHS-02TB  [CHS-02TB]
SJ1  SJ2_0201  [SJ_2_0201]
SJ2  SJ2_0201  [SJ_2_0201]
TP1  TPB1,27  [B1,27]
TP2  TPB1,27  [B1,27]
TP3  TPB2,54  [B2,54]
TP4  TPB1,27  [B1,27]
TP5  TPB1,27  [B1,27]
TP6  TPB1,27  [B1,27]
TP7  TPB1,27  [B1,27]
TP8  TPB2,54  [B2,54]
TP9  TPB2,54  [B2,54]
TP10  TPB2,54  [B2,54]
TP11  TPB1,27  [B1,27]
TP12  TPB1,27  [B1,27]
TP13  TPB1,27  [B1,27]
TP14  TPB1,27  [B1,27]
TP15  TPB1,27  [B1,27]
TP16  TPB1,27  [B1,27]
TP17  TPB2,54  [B2,54]
TP18  TPB2,54  [B2,54]
U1  SN74LVC2G34DCKR  BUFFER-DUAL_SC70  [SC70]
U2  SN65LVDS9638DGN  LVDS_DRIVER_DUAL_MSOP  [MSOP-8-PAD-3X3]
U3  FIN1032MTCX  LVDS_RECEIVER_QUAD_TSSOP  [TSSOP-16]
U4  LTC2875_DFN  [DFN83X3]
U5  ADCMP600  COMPARITOR_ADCMP600  [SOT-23-5]
U6  ADCMP600  COMPARITOR_ADCMP600  [SOT-23-5]
U7  DG1412E  DG141XE_QUAD_SPST_QFN  [QFN16-4X4MM]
U8  DG1412E  DG141XE_QUAD_SPST_QFN  [QFN16-4X4MM]
U9  DG1412E  DG141XE_QUAD_SPST_QFN  [QFN16-4X4MM]
U10  DS90UB934-Q1  [WQFN48-7X7-PAD]
U11  DS90UB934-Q1  [WQFN48-7X7-PAD]
U12  DS91M040  DS91M040_WQFN32  [WQFN32-5X5]
U13  AD5766BCPZ-RL7  AD5767BCBZ-RL7_QFN  [CP_40_7]
U14  MCP47FEB02A0-E/ST  MCP47FEBX2  [TSSOP-8]
U15  LM4132AMF-2.5/NOPBCT-ND  VREF_EN_LM4132  [SOT-23-5]
U16  AD7617BSTZ  [ST_80_2]
U17  AD5142BCPZ10  AD51X2_QFN  [CP_16_27-L]
U18  LTM4622A  LTM4622_BGA  [BGA_5X5_625X625]
U19  TPS62293DRV  TPS6229X_WSON  [WSON6-2X2]
U20  TPS7A49  TPS7AXX_PVSON  [PVSON-N8+4-3X3]
U21  TPS7A49  TPS7AXX_PVSON  [PVSON-N8+4-3X3]
U22  TPS7A30  TPS7AXX_PVSON  [PVSON-N8+4-3X3]
U23  24AA64ST  [TSSOP8]
U24  LTM8049_BGA  [LTM8049]
X2  OE-LOGO_7X5  [OE-LOGO-7X5]
X3  OE-LOGO_7X5  [OE-LOGO-7X5]

## Nets
!ADC_CS [50 Ohm Single Mid]: J10.H13(LA07_P) U16.63(!CS)
!ADC_RESET: J10.F10(HA08_P) R72.2
!DAC_CS [50 Ohm Single Mid]: J10.J16(HA14_N) U13.8(!CS)
!DAC_RESET: J10.F14(HA12_N) U13.3(!RESET)
!LINK_PWR_ADJ_CS: J10.F38(HB20_N) U17.14(!CS)
!LINK_PWR_ADJ_RESET: J10.E37(HB21_N) U17.16(!RESET)
$N1 [50 Ohm Single Top]: D8.3(COMM) F2.2 R5.2 R9.2 R11.2 R15.2 R29.1
$N2 [50 Ohm Single Top]: D6.3(COMM) F3.2 U1.4(OUT2) U1.6(OUT1)
$N3 [50 Ohm Single Top]: D7.3(COMM) F1.2 R4.2 R8.2 R10.2 R14.2 R28.1
+1V8: C88.2 C89.2 C93.2 C94.2 C108.2 L3.2 L4.2 L9.1 L10.1 L13.1 R22.1 R24.1 R40.1 R42.1 TP16.TP U10.17(VDD18) U11.17(VDD18) U19.3(FB)
+3V3: C11.2 C23.1 C24.1 C29.1 C30.1 C33.1 C34.1 C39.1 C76.2 C80.2 C84.2 C91.2 C95.2 C98.2 C113.2 C115.2 C116.2 C119.2 C120.2 C136.2 C137.2 C138.2 C139.1 C140.1 J10.E39(VADJ) J10.F40(VADJ) J10.G39(VADJ) J10.H40(VADJ) J10.J39(VIO_B_M2C) J10.K40(VIO_B_M2C) L11.1 L12.1 R36.2 R37.2 R38.2 R39.2 R46.2 R49.2 R63.2 R64.2 R69.1 R70.1 R71.1 R75.1 R84.2 R85.2 S1.2 S2.2 TP11.TP U1.5(VCC) U2.1(VCC) U3.4(EN) U3.16(VCC) U4.3(VCC) U5.5(V+) U6.5(V+) U10.4(OSS_SEL) U10.5(OEN) U11.4(OSS_SEL) U11.5(OEN) U12.11(VDD) U12.12(VDD) U12.29(VDD) U12.30(VDD) U13.4(VLOGIC) U14.1(VDD) U14.2(REFA) U16.49(VDRIVE) U17.9(VDD) U17.10(VLOGIC) U17.15(INDEP) U19.2(MODE) U19.4(EN) U19.5(VIN) U24.A5(VIN1) U24.A6(VIN1) U24.A7(VIN1) U24.B7(RUN1) U24.K7(RUN2) U24.L5(VIN2) U24.L6(VIN2) U24.L7(VIN2) ; supply symbol labelled +1V8
+5V_AN: C61.2 C64.2 C71.2 C79.2 C83.1 C85.2 C86.2 C87.2 C92.2 C109.2 C110.2 L14.1 R1.2 TP1.TP U13.28(AVCC) U15.3(EN) U15.4(VIN) U16.6(VCC) U16.15(VCC) U16.30(VCC) U16.71(VCC)
+12V: C118.2 C130.2 C133.2 C134.2 J7.1 J7.26 J10.C35(12P0V1) J10.C37(12P0V2) R44.2 R45.2 TP12.TP U18.A2(VIN) U18.B3(VIN) U18.D3(VIN) U18.E2(VIN)
+13V_AN: C8.2 C9.2 C10.2 C106.2 C107.2 L15.1 R2.2 TP2.TP U7.11(V+) U8.11(V+) U9.11(V+) U13.26(AVDD)
+15V: C131.2 L17.2 L18.2 R82.1 U24.A1(VOUT1P) U24.A2(VOUT1P) U24.B1(VOUT1P) U24.B2(VOUT1P)
-13V_AN: C18.2 C19.2 C20.2 C101.2 C105.2 L16.1 R3.2 TP4.TP U7.2(V-) U7.PAD(V-) U8.2(V-) U8.PAD(V-) U9.2(V-) U9.PAD(V-) U13.6(AVSS) U13.PAD(AVSS)
-15V: C132.1 L19.2 R83.1 U24.G1(VOUT2N) U24.G2(VOUT2N) U24.H1(VOUT2N) U24.H2(VOUT2N) U24.J2(VOUT2N)
ADC_BUSY [50 Ohm Single Mid]: J10.J12(HA11_P) U16.67(BUSY)
ADC_CONVST [50 Ohm Single Mid]: J10.K13(HA10_P) U16.68(CONVST)
ADC_MISO_A [50 Ohm Single Mid]: J10.K11(HA06_N) U16.57(DB12/SDOA)
ADC_MISO_B [50 Ohm Single Mid]: J10.J10(HA07_N) U16.56(DB11/SDOB)
ADC_MOSI [50 Ohm Single Mid]: J10.K10(HA06_P) U16.55(DB10/SDI)
ADC_SCLK [50 Ohm Single Mid]: J10.J13(HA11_N) U16.62(SCLK/!RD)
ADDR0: J10.C27(LA27_N) R84.1 S3.4
ADDR1: J10.C26(LA27_P) R85.1 S3.3
AGND: C8.1 C9.1 C10.1 C18.1 C19.1 C20.1 C61.1 C64.1 C71.1 C79.1 C83.2 C85.1 C86.1 C87.1 C90.1 C92.1 C97.1 C101.1 C102.1 C103.1 C105.1 C106.1 C107.1 C109.1 C110.1 D1.C D2.C D3.A J7.13 J7.14 R54.1 R59.C2 R59.C4 R59.C6 R59.C7 R60.C1 R60.C3 R60.C5 R60.C6 R60.C7 R60.C8 R61.C2 R61.C3 R61.C5 R61.C7 R62.C1 R62.C2 R62.C3 R62.C4 R62.C6 R62.C8 TP3.TP U7.3(GND) U8.3(GND) U9.3(GND) U13.10(AGND) U13.20(NIC) U13.23(N0) U13.24(N1) U13.25(NIC) U13.29(AGND) U13.31(NIC) U15.2(GND) U16.5(AGND) U16.16(AGND) U16.29(AGND) U16.32(REFGND) U16.34(REFINOUTGND) U16.69(REGGND) U16.72(AGND)
AIN_AOUT0: J10.F11(HA08_N) U9.15(IN1)
AIN_AOUT1: J10.D11(LA05_P) U9.6(IN4)
AIN_AOUT2: J10.E12(HA13_P) U9.7(IN3)
AIN_AOUT3: J10.H10(LA04_P) U9.14(IN2)
AIN_AOUT4: J10.E18(HA20_P) U8.15(IN1)
AIN_AOUT5: J10.J9(HA07_P) U8.6(IN4)
AIN_AOUT6: J10.G10(LA03_N) U8.7(IN3)
AIN_AOUT7: J10.F17(HA15_N) U8.14(IN2)
AIN_AOUT8: J10.H20(LA15_N) U7.7(IN3)
AIN_AOUT9: J10.J18(HA18_P) U7.14(IN2)
AIN_AOUT10: J10.G19(LA16_N) U7.6(IN4)
AIN_AOUT11: J10.H19(LA15_P) U7.15(IN1)
AIO_0: J7.7 R59.C1 U9.16(D1)
AIO_1: J7.20 R59.C3 U9.5(D4)
AIO_2: J7.8 R59.C5 U9.8(D3)
AIO_3: J7.21 R59.C8 U9.13(D2)
AIO_4: J7.9 R60.C4 U8.16(D1)
AIO_5: J7.22 R60.C2 U8.5(D4)
AIO_6: J7.10 R62.C5 U8.8(D3)
AIO_7: J7.23 R62.C7 U8.13(D2)
AIO_8: J7.11 R61.C6 U7.8(D3)
AIO_9: J7.24 R61.C8 U7.13(D2)
AIO_10: J7.12 R61.C4 U7.5(D4)
AIO_11: J7.25 R61.C1 U7.16(D1)
AOUT0: U7.1(S1) U13.32(VOUT0)
AOUT1: U7.4(S4) U13.33(VOUT1)
AOUT2: U7.9(S3) U13.34(VOUT2)
AOUT3: U7.12(S2) U13.35(VOUT3)
AOUT4: U8.1(S1) U13.36(VOUT4)
AOUT5: U8.4(S4) U13.37(VOUT5)
AOUT6: U8.12(S2) U13.38(VOUT6)
AOUT7: U8.9(S3) U13.39(VOUT7)
AOUT8: U9.9(S3) U13.12(VOUT8)
AOUT9: U9.12(S2) U13.13(VOUT9)
AOUT10: U9.4(S4) U13.14(VOUT10)
AOUT11: U9.1(S1) U13.15(VOUT11)
CAN_N [100 Ohm Diff Mid]: R27.2 SJ1.2 U4.6(CANL)
CAN_P [100 Ohm Diff Mid]: R26.2 SJ2.2 U4.7(CANH)
CAN_RX: J10.K8(HA02_N) U4.4(RXD)
CAN_TX: J10.K7(HA02_P) U4.1(TXD)
CLKIN0: J10.D21(LA17_N_CC) TP7.TP U5.1(OUT)
CLKIN1: J10.E19(HA20_N) TP6.TP U6.1(OUT)
CLKIN_TERM0: J10.K19(HA21_P) R20.1
CLKIN_TERM1: J10.K17(HA17_N_CC) R21.1
CLKIN_VBIAS_SCL: J10.J21(HA22_P) R64.1 U14.7(SCL)
CLKIN_VBIAS_SDA: J10.K20(HA21_N) R63.1 U14.8(SDA)
CLKOUT [50 Ohm Single Mid]: J10.D20(LA17_P_CC) U1.1(IN3) U1.3(IN2)
DAC_MISO [50 Ohm Single Mid]: J10.K16(HA17_P_CC) U13.9(MISO)
DAC_MOSI [50 Ohm Single Mid]: J10.H14(LA07_N) U13.5(MOSI)
DAC_MUX: TP15.TP U13.27(MUX_OUT)
DAC_SCLK [50 Ohm Single Mid]: J10.J15(HA14_P) U13.7(SCLK)
DEBUG0: J8.2 J10.C10(LA06_P)
DEBUG1: J8.4 J10.C11(LA06_N)
DEBUG2: J8.6 J10.D14(LA09_P)
DEBUG3: J8.8 J10.C14(LA10_P)
DEBUG4: J8.10 J10.D15(LA09_N)
DEBUG5: J8.12 J10.C15(LA10_N)
DEBUG6: J8.14 J10.C18(LA14_P)
DEBUG7: J8.16 J10.C19(LA14_N)
DES_A_D0: J10.F34(HB16_P) U11.24(ROUT0)
DES_A_D1: J10.K35(HB14_N) U11.23(ROUT1)
DES_A_D2: J10.J34(HB15_N) U11.22(ROUT2)
DES_A_D3: J10.K34(HB14_P) U11.21(ROUT3)
DES_A_D4: J10.E33(HB19_P) U11.19(ROUT4)
DES_A_D5: J10.J33(HB15_P) U11.18(ROUT5)
DES_A_D6: J10.F32(HB12_N) U11.16(ROUT6)
DES_A_D7: J10.E31(HB13_N) U11.15(ROUT7)
DES_A_D8: J10.K32(HB10_N) U11.14(ROUT8)
DES_A_D9: J10.F31(HB12_P) U11.13(ROUT9)
DES_A_D10: J10.J31(HB11_N) U11.12(ROUT10)
DES_A_D11: J10.K31(HB10_P) U11.11(ROUT11)
DES_A_GPIO0: J10.J37(HB18_N) U11.28(GPIO0)
DES_A_GPIO1: J10.K37(HB17_P_CC) U11.27(GPIO1)
DES_A_GPIO2: J10.J36(HB18_P) U11.26(GPIO2)
DES_A_GPIO3: J10.E34(HB19_N) R49.1 U11.25(GPIO3/INTB)
DES_A_HSYNC: J10.E30(HB13_P) U11.10(HSYNC)
DES_A_LEDG: J10.F28(HB08_P) R53.2
DES_A_LOCK: J10.E27(HB09_P) R48.2 R56.2 U11.48(LOCK)
DES_A_PASS: J10.J28(HB07_N) R51.2 R58.2 U11.47(PASS)
DES_A_PCLK: J10.K28(HB06_P_CC) U11.8(PCLK)
DES_A_PDB: J10.F35(HB16_N) U11.30(PDB)
DES_A_SCL: J10.F29(HB08_N) R37.1 U11.2(SCL)
DES_A_SDA\: J10.E28(HB09_N) R39.1 U11.1(SDA)
DES_A_VSYNC: J10.J30(HB11_P) U11.9(VSYNC)
DES_B_D0: J10.H29(LA24_N) U10.24(ROUT0)
DES_B_D1: J10.H28(LA24_P) U10.23(ROUT1)
DES_B_D2: J10.G28(LA25_N) U10.22(ROUT2)
DES_B_D3: J10.G27(LA25_P) U10.21(ROUT3)
DES_B_D4: J10.D27(LA26_N) U10.19(ROUT4)
DES_B_D5: J10.D26(LA26_P) U10.18(ROUT5)
DES_B_D6: J10.H26(LA21_N) U10.16(ROUT6)
DES_B_D7: J10.G25(LA22_N) U10.15(ROUT7)
DES_B_D8: J10.H25(LA21_P) U10.14(ROUT8)
DES_B_D9: J10.D24(LA23_N) U10.13(ROUT9)
DES_B_D10: J10.G24(LA22_P) U10.12(ROUT10)
DES_B_D11: J10.D23(LA23_P) U10.11(ROUT11)
DES_B_GPIO0: J10.H32(LA28_N) U10.28(GPIO0)
DES_B_GPIO1: J10.G31(LA29_N) U10.27(GPIO1)
DES_B_GPIO2: J10.H31(LA28_P) U10.26(GPIO2)
DES_B_GPIO3: J10.G30(LA29_P) R46.1 U10.25(GPIO3/INTB)
DES_B_HSYNC\: J10.H23(LA19_N) U10.10(HSYNC)
DES_B_LEDG: J10.G21(LA20_P) R52.2
DES_B_LOCK: J10.J22(HA22_N) R47.2 R55.2 U10.48(LOCK)
DES_B_PASS: J10.K22(HA23_P) R50.2 R57.2 U10.47(PASS)
DES_B_PCLK: J10.C22(LA18_P_CC) U10.8(PCLK)
DES_B_PDB: J10.G33(LA31_P) U10.30(PDB)
DES_B_SCL: J10.G22(LA20_N) R36.1 U10.2(SCL)
DES_B_SDA: J10.H22(LA19_P) R38.1 U10.1(SDA)
DES_B_VSYNC: J10.K23(HA23_N) U10.9(VSYNC)
DI_VBIAS0: R18.1 U14.3(VOUT0)
DI_VBIAS1: R19.1 U14.4(VOUT1)
DOUTP_F_A [Link]: C47.2 D5.C J2.SIG L2.2 R7.2
DOUTP_F_B [Link]: C46.2 D4.C J1.SIG L1.2 R6.2
GND: C1.1 C2.1 C3.1 C4.1 C5.2 C6.1 C7.1 C11.1 C12.1 C13.1 C14.2 C15.2 C16.2 C17.2 C21.1 C22.1 C23.2 C24.2 C25.1 C26.1 C27.1 C28.1 C29.2 C30.2 C31.2 C32.2 C33.2 C34.2 C35.1 C36.1 C37.1 C38.1 C39.2 C42.1 C43.1 C44.1 C45.1 C48.1 C49.1 C50.1 C51.1 C52.1 C53.1 C54.1 C55.1 C56.1 C57.1 C58.1 C59.1 C60.1 C62.1 C63.1 C65.1 C66.1 C67.1 C68.1 C69.1 C70.1 C72.1 C73.1 C74.1 C75.1 C76.1 C77.1 C78.1 C80.1 C81.1 C82.1 C84.1 C88.1 C89.1 C91.1 C93.1 C94.1 C95.1 C96.1 C98.1 C99.1 C100.1 C104.1 C108.1 C111.1 C112.1 C113.1 C114.1 C115.1 C116.1 C117.2 C118.1 C119.1 C120.1 C121.1 C122.1 C123.1 C124.2 C125.2 C126.2 C127.1 C128.1 C129.1 C130.1 C131.1 C132.2 C133.1 C134.1 C135.1 C136.1 C137.1 C138.1 C139.2 C140.2 D4.A D5.A D6.1(A) D7.1(A) D8.1(A) D9.A D10.3(C) D10.5(C) D10.6(C) D11.3(C) D11.5(C) D11.6(C) J1.GND@1 J1.GND@2 J1.GND@3 J1.GND@4 J2.GND@1 J2.GND@2 J2.GND@3 J2.GND@4 J3.GND@1 J3.GND@2 J3.GND@3 J3.GND@4 J4.GND@1 J4.GND@2 J4.GND@3 J4.GND@4 J5.GND@1 J5.GND@2 J5.GND@3 J5.GND@4 J7.PAD1 J7.PAD2 J8.1 J8.3 J8.5 J8.7 J8.9 J8.11 J8.13 J8.15 J10.A1(GND) J10.A4(GND) J10.A5(GND) J10.A8(GND) J10.A9(GND) J10.A12(GND) J10.A13(GND) J10.A16(GND) J10.A17(GND) J10.A20(GND) J10.A21(GND) J10.A24(GND) J10.A25(GND) J10.A28(GND) J10.A29(GND) J10.A32(GND) J10.A33(GND) J10.A36(GND) J10.A37(GND) J10.A40(GND) J10.B2(GND) J10.B3(GND) J10.B6(GND) J10.B7(GND) J10.B10(GND) J10.B11(GND) J10.B14(GND) J10.B15(GND) J10.B18(GND) J10.B19(GND) J10.B22(GND) J10.B23(GND) J10.B26(GND) J10.B27(GND) J10.B30(GND) J10.B31(GND) J10.B34(GND) J10.B35(GND) J10.B38(GND) J10.B39(GND) J10.C1(GND) J10.C4(GND) J10.C5(GND) J10.C8(GND) J10.C9(GND) J10.C12(GND) J10.C13(GND) J10.C16(GND) J10.C17(GND) J10.C20(GND) J10.C21(GND) J10.C24(GND) J10.C25(GND) J10.C28(GND) J10.C29(GND) J10.C32(GND) J10.C33(GND) J10.C34(GA0) J10.C36(GND) J10.C38(GND) J10.C40(GND) J10.D2(GND) J10.D6(GND) J10.D7(GND) J10.D10(GND) J10.D13(GND) J10.D16(GND) J10.D19(GND) J10.D22(GND) J10.D25(GND) J10.D28(GND) J10.D35(GA1) J10.D39(GND) J10.E1(GND) J10.E5(GND) J10.E8(GND) J10.E11(GND) J10.E14(GND) J10.E17(GND) J10.E20(GND) J10.E23(GND) J10.E26(GND) J10.E29(GND) J10.E32(GND) J10.E35(GND) J10.E38(GND) J10.E40(GND) J10.F2(GND) J10.F3(GND) J10.F6(GND) J10.F9(GND) J10.F15(GND) J10.F18(GND) J10.F21(GND) J10.F24(GND) J10.F27(GND) J10.F30(GND) J10.F33(GND) J10.F36(GND) J10.F39(GND) J10.G1(GND) J10.G4(GND) J10.G5(GND) J10.G8(GND) J10.G11(GND) J10.G14(GND) J10.G17(GND) J10.G20(GND) J10.G23(GND) J10.G26(GND) J10.G29(GND) J10.G32(GND) J10.G35(GND) J10.G38(GND) J10.G40(GND) J10.H3(GND) J10.H6(GND) J10.H9(GND) J10.H12(GND) J10.H15(GND) J10.H18(GND) J10.H21(GND) J10.H24(GND) J10.H27(GND) J10.H30(GND) J10.H33(GND) J10.H36(GND) J10.H39(GND) J10.J1(GND) J10.J4(GND) J10.J5(GND) J10.J8(GND) J10.J11(GND) J10.J14(GND) J10.J17(GND) J10.J20(GND) J10.J23(GND) J10.J26(GND) J10.J29(GND) J10.J32(GND) J10.J35(GND) J10.J38(GND) J10.J40(GND) J10.K2(GND) J10.K3(GND) J10.K6(GND) J10.K9(GND) J10.K12(GND) J10.K15(GND) J10.K18(GND) J10.K21(GND) J10.K24(GND) J10.K27(GND) J10.K30(GND) J10.K33(GND) J10.K36(GND) J10.K39(GND) Q1.2(S) Q2.2(S) R4.1 R5.1 R16.1 R17.1 R23.2 R25.2 R33.1 R34.2 R35.2 R41.2 R43.2 R54.2 R55.1 R56.1 R57.1 R58.1 R68.2 R73.2 R74.2 R77.1 R79.1 R81.1 R86.2 R87.2 S3.1 S3.2 TP8.TP TP9.TP TP10.TP TP17.TP TP18.TP U1.2(GND) U2.4(GND) U2.PAD(GND) U3.8(GND) U3.12(!EN) U4.2(GND) U4.PAD(GND) U5.2(V-) U6.2(V-) U10.43(RES1) U10.44(RES2) U10.46(SEL) U10.PAD(GND) U11.43(RES1) U11.44(RES2) U11.46(SEL) U11.PAD(GND) U12.31(GND) U12.PAD(GND) U13.2(DGND) U14.5(AVSS) U14.6(LAT/HVC) U16.37(SEQEN) U16.38(HW_RNGSEL1) U16.39(HW_RNGSEL0) U16.41(DB0) U16.42(DB1) U16.43(DB2) U16.44(DB3) U16.46(DB5/CRCEN) U16.47(DB6) U16.48(DB7) U16.50(DGND) U16.51(REGGNDD) U16.53(DB8) U16.54(DB9) U16.58(DB13/OS0) U16.59(DB14/OS1) U16.60(DB15/OS2) U16.61(WR!/BURST) U16.64(CHSEL0) U16.65(CHSEL1) U16.66(CHSEL2) U17.1(GND) U17.3(W1) U17.5(VSS) U17.7(W2) U17.PAD(VSS) U18.B5(GND) U18.C1(GND) U18.C2(GND) U18.C5(SYNC/MODE) U18.D5(GND) U19.6(GND) U19.PAD(GND) U20.3(NC) U20.4(GND) U20.PAD1(PAD) U20.PAD2(PAD) U20.PAD3(PAD) U20.PAD4(PAD) U20.PAD5(PAD) U21.3(NC) U21.4(GND) U21.PAD1(PAD) U21.PAD2(PAD) U21.PAD3(PAD) U21.PAD4(PAD) U21.PAD5(PAD) U22.3(NC) U22.4(GND) U22.PAD1(PAD) U22.PAD2(PAD) U22.PAD3(PAD) U22.PAD4(PAD) U22.PAD5(PAD) U23.1(A0) U23.2(A1) U23.3(A2) U23.4(GND) U23.7(WP) U24.A3(GND) U24.A4(GND) U24.B3(GND) U24.B4(GND) U24.B5(GND) U24.B6(GND) U24.C2(VOUT1N) U24.C3(GND) U24.C4(GND) U24.C5(GND) U24.C6(GND) U24.D1(VOUT1N) U24.D2(VOUT1N) U24.D3(GND) U24.D4(GND) U24.D5(GND) U24.D7(SYNC1) U24.E1(VOUT1N) U24.E2(VOUT1N) U24.E3(GND) U24.E4(GND) U24.E5(GND) U24.F1(GND) U24.F2(GND) U24.F5(GND) U24.F6(GND) U24.F7(GND) U24.G3(GND) U24.G4(GND) U24.G5(GND) U24.H3(GND) U24.H4(GND) U24.H5(GND) U24.J3(GND) U24.J4(GND) U24.J5(GND) U24.J6(GND) U24.K1(VOUT2P) U24.K2(VOUT2P) U24.K3(GND) U24.K4(GND) U24.K5(GND) U24.K6(GND) U24.L1(VOUT2P) U24.L2(VOUT2P) U24.L3(GND) U24.L4(GND)
LINK_A_PWR_EN: J10.H37(LA32_P) R74.1 U18.B2(RUN2)
LINK_B_PWR_EN: J10.K38(HB17_N_CC) R73.1 U18.D2(RUN1)
LINK_PWR_ADJ_MISO: J10.F37(HB20_P) R75.2 U17.13(MISO)
LINK_PWR_ADJ_MOSI: J10.E36(HB21_P) U17.12(MOSI)
LINK_PWR_ADJ_SCLK: J10.H38(LA32_N) U17.11(SCLK)
LVDS_DIN0 [100 Ohm Diff Mid]: J10.J2(CLK1_C2M_P) U3.3(AOUT)
LVDS_DIN0_N [100 Ohm Diff Mid]: J7.4 R30.1 U3.1(A-)
LVDS_DIN0_P [100 Ohm Diff Mid]: J7.17 R30.2 U3.2(A+)
LVDS_DIN1 [100 Ohm Diff Mid]: J10.H5(CLK0_M2C_N) U3.5(BOUT)
LVDS_DIN1_N [100 Ohm Diff Mid]: J7.16 R31.1 U3.7(B-)
LVDS_DIN1_P [100 Ohm Diff Mid]: J7.3 R31.2 U3.6(B+)
LVDS_DIN2 [100 Ohm Diff Mid]: J10.H4(CLK0_M2C_P) U3.11(COUT)
LVDS_DIN2_N [100 Ohm Diff Mid]: R32.1 SJ2.1 U3.9(C-)
LVDS_DIN2_N/CAN_P: J7.2 SJ2.COM
LVDS_DIN2_P [100 Ohm Diff Mid]: R32.2 SJ1.1 U3.10(C+)
LVDS_DIN2_P/CAN_N: J7.15 SJ1.COM
LVDS_DOUT0 [100 Ohm Diff Mid]: J10.J3(CLK1_C2M_N) U2.2(AIN)
LVDS_DOUT0_N [100 Ohm Diff Mid]: J7.19 U2.7(AOUT-)
LVDS_DOUT0_P [100 Ohm Diff Mid]: J7.6 U2.8(AOUT+)
LVDS_DOUT1 [100 Ohm Diff Mid]: J10.K4(CLK1_M2C_P) U2.3(BIN)
LVDS_DOUT1_N [100 Ohm Diff Mid]: J7.18 U2.5(BOUT-)
LVDS_DOUT1_P [100 Ohm Diff Mid]: J7.5 U2.6(BOUT+)
MLDVS_EN: J10.H8(LA02_N) U12.10(MDE)
MLDVS_RO0: J10.G2(CLK0_C2M_P) U12.1(RO0)
MLDVS_RO1: J10.E3(HA01_N_CC) U12.3(RO1)
MLDVS_RO2: J10.G7(LA00_N_CC) U12.5(RO2)
MLDVS_RO3: J10.F4(HA00_P_CC) U12.7(RO3)
MLVDS_CLK_0_N [130 Ohm Diff Top]: J6.9 U12.24(B0)
MLVDS_CLK_0_P [130 Ohm Diff Top]: J6.10 U12.23(A0)
MLVDS_CLK_1_N [130 Ohm Diff Top]: J6.7 U12.22(B1)
MLVDS_CLK_1_P [130 Ohm Diff Top]: J6.8 U12.21(A1)
MLVDS_CLK_2_N [130 Ohm Diff Top]: J6.3 U12.20(B2)
MLVDS_CLK_2_P [130 Ohm Diff Top]: J6.4 U12.19(A2)
MLVDS_CLK_3_N [130 Ohm Diff Top]: J6.1 U12.18(B3)
MLVDS_CLK_3_P [130 Ohm Diff Top]: J6.2 U12.17(A3)
MLVDS_DE_!RE0: J10.F7(HA04_P) U12.25(DE0) U12.26(!RE0)
MLVDS_DE_!RE1: J10.E7(HA05_N) U12.27(DE1) U12.28(!RE1)
MLVDS_DE_!RE2: J10.H7(LA02_P) U12.13(!RE2) U12.14(DE2)
MLVDS_DE_!RE3: J10.F8(HA04_N) U12.15(!RE3) U12.16(DE3)
MLVDS_DI0: J10.G3(CLK0_C2M_N) U12.2(DI0)
MLVDS_DI1: J10.E2(HA01_P_CC) U12.4(DI1)
MLVDS_DI2: J10.G6(LA00_P_CC) U12.6(DI2)
MLVDS_DI3: J10.F5(HA00_N_CC) U12.8(DI3)
N$1: L13.2 U19.1(SW)
N$2: Q1.3(D) R8.1 R10.1 R14.1
N$3: R28.2 U5.3(+IN)
N$4: L1.1 L5.2 R6.1 R12.2
N$5: R67.1 U18.A4(FB2)
N$6 [50 Ohm Single Top]: F2.1 J4.SIG
N$7: Q2.3(D) R9.1 R11.1 R15.1
N$8: C112.2 U18.A3(TRACK/SS2)
N$9: R87.1 U24.G7(RT2)
N$10: R66.1 U18.E4(FB1)
N$11 [50 Ohm Single Top]: F1.1 J3.SIG
N$12: C114.2 U18.E3(TRACK/SS1)
N$13: R33.2 U4.8(RS)
N$14 [50 Ohm Single Top]: F3.1 J5.SIG
N$15: C127.2 L17.1 U20.5(EN) U20.8(IN)
N$16: D11.4(A) R53.1
N$17: R86.1 U24.E7(RT1)
N$18: C14.1 R18.2 U5.4(-IN)
N$19: R29.2 U6.3(+IN)
N$20: C15.1 R19.2 U6.4(-IN)
N$21: L2.1 L6.2 R7.1 R13.2
N$22: C7.2 C17.1 L6.1 L8.2 R13.1
N$23: R61.1 U16.79(V3B)
N$24: C6.2 C16.1 L5.1 L7.2 R12.1
N$25: R83.2 U24.J1(FBX2)
N$26: D10.4(A) R52.1
N$27: C47.1 U11.41(RIN0+)
N$28: C41.1 U11.42(RIN0-)
N$29: R82.2 U24.C1(FBX1)
N$30: C37.2 C44.2 C49.2 U11.3(VDD11_D)
N$31: C38.2 C45.2 U11.20(VDD11_DVP)
N$32: C41.2 R35.1
N$33: C124.1 U20.6(NR/SS)
N$34: Q2.1(G) R17.2 R21.2
N$35: U24.E6(CLKOUT1) U24.H7(SYNC2)
N$36: D3.C R3.1
N$37: Q1.1(G) R16.2 R20.2
N$38: C46.1 U10.41(RIN0+)
N$39: R61.2 U16.80(V3BGND)
N$40: R76.1 R77.2 U20.2(FB)
N$41: C5.1 R26.1 R27.1 U4.5(SPLIT)
N$42: C128.2 L18.1 U21.5(EN) U21.8(IN)
N$43: C125.1 U21.6(NR/SS)
N$45: C70.2 C78.2 C82.2 U11.34(VDD11_FPD)
N$46: C117.1 R72.1 U16.36(!RESET)
N$47: C57.2 C62.2 C66.2 C73.2 L11.2 U10.7(VDDIO) U10.29(VDDIO)
N$48: C35.2 C42.2 C48.2 U10.3(VDD11_D)
N$49: C36.2 C43.2 U10.20(VDD11_DVP)
N$50: C69.2 C77.2 C81.2 U10.34(VDD11_FPD)
N$53: D11.1(A) R48.1
N$54: D11.2(A) R51.1
N$55: C40.1 U10.42(RIN0-)
N$56: R78.1 R79.2 U21.2(FB)
N$57: D1.A R1.1
N$58: C129.2 L19.1 U22.5(EN) U22.8(IN)
N$59: C126.1 U22.6(NR/SS)
N$60: R80.1 R81.2 U22.2(FB)
N$61: R71.2 U16.45(DB4/!SER1WR)
N$62: R59.1 U16.28(V0A)
N$63: R70.2 U16.40(SER/!PAR)
N$64: C97.2 U16.31(REFCAP)
N$65: R59.2 U16.27(V0AGND)
N$66: D2.A R2.1
N$67: C111.2 U16.52(REGCAPD)
N$68: R61.8 U16.73(V0B)
N$69: C103.2 U16.70(REGCAP)
N$71: R69.2 U16.35(REFSEL)
N$72: R62.7 U16.2(V4B)
N$73: R62.1 U16.10(V7BGND)
N$74: R61.7 U16.74(V0BGND)
N$75: R61.6 U16.75(V1B)
N$76: R61.5 U16.76(V1BGND)
N$77: R61.4 U16.77(V2B)
N$78: R61.3 U16.78(V2BGND)
N$79: R59.3 U16.26(V1A)
N$80: R59.4 U16.25(V1AGND)
N$81: R59.5 U16.24(V2A)
N$82: R59.6 U16.23(V2AGND)
N$83: R59.8 U16.22(V3A)
N$84: R59.7 U16.21(V3AGND)
N$85: R60.2 U16.19(V4A)
N$86: R60.1 U16.20(V4AGND)
N$87: R60.4 U16.17(V5A)
N$88: R60.3 U16.18(V5AGND)
N$89: R60.5 U16.14(V6A)
N$90: R60.6 U16.13(V6AGND)
N$91: R60.7 U16.12(V7A)
N$92: R60.8 U16.11(V7AGND)
N$93: C40.2 R34.1
N$94: R62.8 U16.1(V4BGND)
N$95: R62.5 U16.4(V5B)
N$96: R62.6 U16.3(V5BGND)
N$97: R62.4 U16.7(V6B)
N$98: R62.3 U16.8(V6BGND)
N$99: R62.2 U16.9(V7B)
N$100: R40.2 R41.1 U10.35(IDX)
N$118: D10.1(A) R47.1
N$119: D10.2(A) R50.1
N$122: R66.2 U17.2(A1)
N$123: R67.2 U17.6(A2)
N$145: R68.1 U18.C4(FREQ)
N$200: C58.2 C63.2 C68.2 C75.2 L12.2 U11.7(VDDIO) U11.29(VDDIO)
N$402: S2.1 U11.6(BISTEN)
N$403: R24.2 R25.1 U11.37(MODE)
N$404: R42.2 R43.1 U11.35(IDX)
N$500: C121.2 L14.2 R76.2 U20.1(OUT)
N$501: C122.2 L15.2 R78.2 U21.1(OUT)
N$502: C123.2 L16.2 R80.2 U22.1(OUT)
N$506: C102.2 R65.1 U16.33(REFINOUT)
N$603: S1.1 U10.6(BISTEN)
N$604: R22.2 R23.1 U10.37(MODE)
SCL: J10.C30(SCL) U23.6(SCL)
SDA: J10.C31(SDA) U23.5(SDA)
TDI-TDO: J10.D30(TDI) J10.D31(TDO)
V_PROTECT: C54.2 D6.2(C) D7.2(C) D8.2(C) D9.C R44.1 R45.1 TP5.TP
VAUX: C135.2 J10.D32(3P3VAUX) U23.8(VCC)
VDD_FPDX_A: C2.2 C4.2 C13.2 C22.2 C26.2 L4.1 U11.31(VDD18_FPD1) U11.40(VDD18_FPD0)
VDD_FPDX_B: C1.2 C3.2 C12.2 C21.2 C25.2 L3.1 U10.31(VDD18_FPD1) U10.40(VDD18_FPD0)
VDD_PX_A: C51.2 C53.2 C56.2 C60.2 C67.2 C74.2 L10.2 U11.36(VDD18_P1) U11.45(VDD18_P0)
VDD_PX_B: C50.2 C52.2 C55.2 C59.2 C65.2 C72.2 L9.2 U10.36(VDD18_P1) U10.45(VDD18_P0)
VLINK_A: C28.2 C32.1 C96.2 C99.2 L8.1 TP13.TP U18.A1(VOUT2) U18.B1(VOUT2)
VLINK_B: C27.2 C31.1 C100.2 C104.2 L7.1 TP14.TP U18.D1(VOUT1) U18.E1(VOUT1)
VREF: C90.2 R65.2 U13.22(VREF) U15.5(VOUT)
Unconnected: J6.5 J6.6 J9.BEZ1 J9.BEZ2 J10.A2(DP1_M2C_P) J10.A3(DP1_M2C_N) J10.A6(DP2_M2C_P) J10.A7(DP2_M2C_N) J10.A10(DP3_M2C_P) J10.A11(DP3_M2C_N) J10.A14(DP4_M2C_P) J10.A15(DP4_M2C_N) J10.A18(DP5_M2C_P) J10.A19(DP5_M2C_N) J10.A22(DP1_C2M_P) J10.A23(DP1_C2M_N) J10.A26(DP2_C2M_P) J10.A27(DP2_C2M_N) J10.A30(DP3_C2M_P) J10.A31(DP3_C2M_N) J10.A34(DP4_C2M_P) J10.A35(DP4_C2M_N) J10.A38(DP5_C2M_P) J10.A39(DP5_C2M_N) J10.B1(RES1) J10.B4(DP9_M2C_P) J10.B5(DP9_M2C_N) J10.B8(DP8_M2C_P) J10.B9(DP8_M2C_N) J10.B12(DP7_M2C_P) J10.B13(DP7_M2C_N) J10.B16(DP6_M2C_P) J10.B17(DP6_M2C_N) J10.B20(GBTCLK1_M2C_P) J10.B21(GBTCLK1_M2C_N) J10.B24(DP9_C2M_P) J10.B25(DP9_C2M_N) J10.B28(DP8_C2M_P) J10.B29(DP8_C2M_N) J10.B32(DP7_C2M_P) J10.B33(DP7_C2M_N) J10.B36(DP6_C2M_P) J10.B37(DP6_C2M_N) J10.B40(RES0) J10.C2(DP0_C2M_P) J10.C3(DP0_C2M_N) J10.C6(DP0_M2C_P) J10.C7(DP0_M2C_N) J10.C23(LA18_N_CC) J10.C39(3P3V1) J10.D1(PG_C2M) J10.D4(GBTCLK0_M2C_P) J10.D5(GBTCLK0_M2C_N) J10.D8(LA01_P_CC) J10.D9(LA01_N_CC) J10.D12(LA05_N) J10.D17(LA13_P) J10.D18(LA13_N) J10.D29(TCK) J10.D33(TMS) J10.D34(TRST_L) J10.D36(3P3V2) J10.D38(3P3V3) J10.D40(3P3V4) J10.E6(HA05_P) J10.E9(HA09_P) J10.E10(HA09_N) J10.E13(HA13_N) J10.E15(HA16_P) J10.E16(HA16_N) J10.E21(HB03_P) J10.E22(HB03_N) J10.E24(HB05_P) J10.E25(HB05_N) J10.F1(PG_M2C) J10.F13(HA12_P) J10.F16(HA15_P) J10.F19(HA19_P) J10.F20(HA19_N) J10.F22(HB02_P) J10.F23(HB02_N) J10.F25(HB04_P) J10.F26(HB04_N) J10.G9(LA03_P) J10.G12(LA08_P) J10.G13(LA08_N) J10.G15(LA12_P) J10.G16(LA12_N) J10.G18(LA16_P) J10.G34(LA31_N) J10.G36(LA33_P) J10.G37(LA33_N) J10.H1(VREF_A_M2C) J10.H2(PRSNT_M2C_L) J10.H11(LA04_N) J10.H16(LA11_P) J10.H17(LA11_N) J10.H34(LA30_P) J10.H35(LA30_N) J10.J6(HA03_P) J10.J7(HA03_N) J10.J19(HA18_N) J10.J24(HB01_P) J10.J25(HB01_N) J10.J27(HB07_P) J10.K1(VREF_B_M2C) J10.K5(CLK1_M2C_N) J10.K14(HA10_N) J10.K25(HB00_P_CC) J10.K26(HB00_N_CC) J10.K29(HB06_N_CC) U3.13(DOUT) U3.14(D+) U3.15(D-) U10.32(RIN1+) U10.33(RIN1-) U10.38(CMLOUTP) U10.39(CMLOUTN) U11.32(RIN1+) U11.33(RIN1-) U11.38(CMLOUTP) U11.39(CMLOUTN) U12.9(FSEN2) U12.32(FSEN1) U13.1(DNC) U13.11(DNC) U13.16(VOUT12) U13.17(VOUT13) U13.18(VOUT14) U13.19(VOUT15) U13.21(DNC) U13.30(DNC) U13.40(DNC) U17.4(B1) U17.8(B2) U18.A5(COMP2) U18.B4(PGOOD2) U18.C3(INTVCC) U18.D4(PGOOD1) U18.E5(COMP1) U20.7(DNC) U21.7(DNC) U22.7(DNC) U24.C7(SS1) U24.D6(PG1) U24.F3(SHARE1) U24.F4(SHARE2) U24.G6(CLKOUT2) U24.H6(PG2) U24.J7(SS2)

## Notes on the sheet
- ANALOG IO
- NB: Worst case 100 mA draw from
  both ADC and DAC. With 10V stepdown, 
  this is 1W dissipation.
- ANALOG POWER
- FMC IO
- PIN COUNTS
  - Total IO pins: 114
  
  - LVDS pairs: 5 (TPs)
  - SE pins: 104 (Others)
  
  - LVDS CC pairs: 1 (TP0)
  - SE CC pins: 9 (PCLKs, 
  DIs, DOs, MVLDSs)
- PIN       ADC    DAC
  --------------------------
  AIO_11   3B     0
  AIO_10   2B     1
  AIO_9     0B     3
  AIO_8     1B     2
  AIO_7     4B     6
  AIO_6     5B     7
  AIO_5     4A     5
  AIO_4     5A     4
  AIO_3     3A     9
  AIO_2     2A     8
  AIO_1     1A     10
  AIO_0     0A     11
- HPC FMC
- DNP
- DNP
- NB: For best performance,
  quads should only be input
  or output, not mixtures.
- DNP
- DNP
- DNP
- NB: Use both 
  MISO lines
- DNP
- DNP
- DNP
- DNP
- Quad 1
- DNP
- DNP
- Quad 2
- DNP
- DNP
- Quad 3
- DNP
- TP1 | DNP
- NB: P,N order 
  matches SDR
  datasheet spec.
- TP2
- DNP
- TP3 | DNP
- TP4
- DNP
- TP5 | DNP
- NB: R-arrays provide input
  protection. Limit current 
  thru internal clamp 
  diodes to 10 mA at 20V.
- NB: DC signals
  so no worries 
  about DGND
- NB: TO MRCC Pin
- NB: TO MRCC Pin
- NB: Rs set to allow up to 4 Mbps.
- DNP
- DNP
- CLK/TRIGGER I/0 | DNP
- CLK IN 0
- NB: DI0 and DO0
  go to CC pins
- NB: Default 
  VBIAS = 1.65V
- NB: Pulled up to 3.3V on carrier
- NB: Input
  protection
  voltage ~4.6V
- NB: GA0 and GA1 
  define the LSBs of 
  the EEPROM I2C address.
  We use 0x1010000
- NB: TO CC Pin
- CLK IN 1
- NB: TO CC Pin
- INTERNAL
  CLK/TRIG
- LINK POWER
- CLK OUT
- NB: Freq =
  1.48 MHz
- NB: 3.48k =
  11V output.
- NB: VADJ must be set
  to 1.8V on host board!
- SYNC
- NB: VLINK adjust.
  - Max step down ratio: 1 - (45e-9 *1.48e6) = 0.933
  - So max voltage = 11.19
  - Linear mode selected
  - R_AW = 0 : VLINK = 11.0V
  - R_AW = 5k : VLINK = 5.0V
  - General:
    VLINK = 36.24k/(3.48k + R_AW) + 0.6
- DEBUG
- DNP
- LINK B
- NB: PCLK goes 
  to dedicated
  MRCC pin
- Power: ~1.3A DC at 12V; 15.6W. With
  90% efficiency regulation to 5.5V at
  serializer, this translates to 2.55A
  available, which is enough for 1A/LED 
  + 500 mA serializer and FPGA.
- L2 is the smallest package size I could
  find that barely meets current saturation
  requriements. An 8x8mm device that is
  probably safer is the Bourns SRN8040TA
  series.
- LINK B
- DES CORE POWER
- LINK A
- NB: PCLK goes
  to dedicated
  MRCC pin
- NB: FMC FRU 
  module. Required 
  by FMC standard.
- FMC
- NB: Board address
- Power: ~1.3A DC at 12V; 15.6W. With
  90% efficiency regulation to 5.5V at
  serializer, this translates to 2.55A
  available, which is enough for 1A/LED 
  + 500 mA serializer and FPGA.
- L2 is the smallest package size I could
  find that barely meets current saturation
  requriements. An 8x8mm device that is
  probably safer is the Bourns SRN8040TA
  series.
- LINK A
- NB: Standoff connectors
  on front bezel and on 
  FMC connector should
  be isolated from GND
  and tied to chassis ground
  to form a star connection.
- FMC IO

## Power pins joined to a net without a drawn wire
GND: J10.D3(GND) J10.D37(GND) J10.E4(GND) J10.F12(GND)

## Library data of the parts
C1-C41 C43 C45-C60 C62 C63 C65 C67 C69 C70 C72-C75 C80-C89 C91-C96 C99-C102 C104 C106 C108 C109 C112-C114 C116 C117 C120 C124-C126 C130-C140 = jonnew:C: Capacitor
C42 C44 C61 C64 C66 C68 C71 C76-C79 C90 C97 C98 C103 C105 C107 C110 C111 C115 C118 C119 C121-C123 C127-C129 = jonnew:C: Capacitor; MN: TDK Corp.; PARTNO: C2012X5R1Cxxxxxxx; VID: DK
D1-D3 = jonnew:LED: Surface mount LED
D4 D5 D9 = jonnew:Z-DIODE: Zener Diode
D6-D8 = jonnew:DIODE2
D10 D11 = jonnew:LED_3X
F1-F3 = jonnew:FUSE
J1-J5 = jonnew:COAX: COAX CONNECTOR - Edge mount BNC - Vertical BNC - Vertical SMA - etc
J6 = jonnew:PINHD-2X5
J7 = jonnew:PINHD-1X26
J8 = jonnew:PINHD-2X8
J9 = jonnew:FMC_SINGLE_WIDTH_MODULE
J10 = jonnew:FMC_HPC_400_PIN
L1-L13 = jonnew:L: Inductor
L14-L19 = jonnew:L: Inductor; PARTNO: BLM15PX601SN1D
Q1 Q2 = jonnew:N-MOSFET: N-CHANNEL MOS FET SYMBOL
R1-R7 R12 R13 R16-R58 R63-R87 = jonnew:R: Resistor
R8-R11 R14 R15 = jonnew:R: Resistor; DK: PxxxxHTR-ND; MN: Panasonic; MPN: ERJ-3EKFxxxxV
R59-R62 = jonnew:RN2X8
S1 S2 = jonnew:DIPSW-001
S3 = jonnew:DIPSW-002: Dip Switch 2 pol.
SJ1 SJ2 = jonnew:SJ2: SMD solder JUMPER
TP1-TP18 = jonnew:TP: Test pad
U1 = jonnew:BUFFER-DUAL
U2 = jonnew:LVDS_DRIVER_DUAL
U3 = jonnew:LVDS_RECEIVER_QUAD
U4 = jonnew:LTC2875
U5 U6 = jonnew:COMPARITOR
U7-U9 = jonnew:DG141XE_QUAD_SPST
U10 U11 = jonnew:DS90UB934-Q1
U12 = jonnew:DS91M040
U13 = jonnew:AD5767BCBZ-RL7
U14 = jonnew:MCP47FEBX2
U15 = jonnew:VREF_EN
U16 = jonnew:AD7617BSTZ; MANUFACTURER_PART_NUMBER: AD7617BSTZ; VENDOR: Analog Devices Inc
U17 = jonnew:AD51X2
U18 = jonnew:LTM4622
U19 = jonnew:TPS6229X
U20-U22 = jonnew:TPS7AXX: ?36V, ?200mA, Ultralow-Noise, Negative LINEAR REGULATOR
U23 = jonnew:24*: Serial EEPROM I2C; MPN: 25AA640A-I/ST; OC_FARNELL: 1818513; OC_NEWARK: 27M1300
U24 = jonnew:LTM8049
X2 X3 = jonnew:OE-LOGO

## Net classes
1 130 Ohm Diff Top: width 0.09 mm, drill 0.2 mm, clearance 0.089 mm
2 50 Ohm Single Top: width 0.15 mm, drill 0.2 mm
3 100 Ohm Diff Mid: width 0.19 mm, drill 0.2 mm, clearance 0.09 mm
4 50 Ohm Single Mid: width 0.2 mm, drill 0.2 mm
5 100 Ohm Diff Top: width 0.15 mm, drill 0.2 mm, clearance 0.09 mm
6 Link: width 0.15 mm, drill 0.2 mm, clearance 0.5 mm
7 CAN 210 Diff Top: width 0.11 mm, drill 0.2 mm, clearance 0.09 mm